# EAGLE schematic rev01 (EAGLE 7.3.0)
CrypTech Novena dev-bridge Revision 01 (c) NORDUnet A/S

## Sheet 1 of 7: CrypTech avalanche noise evaluation board, rev 02
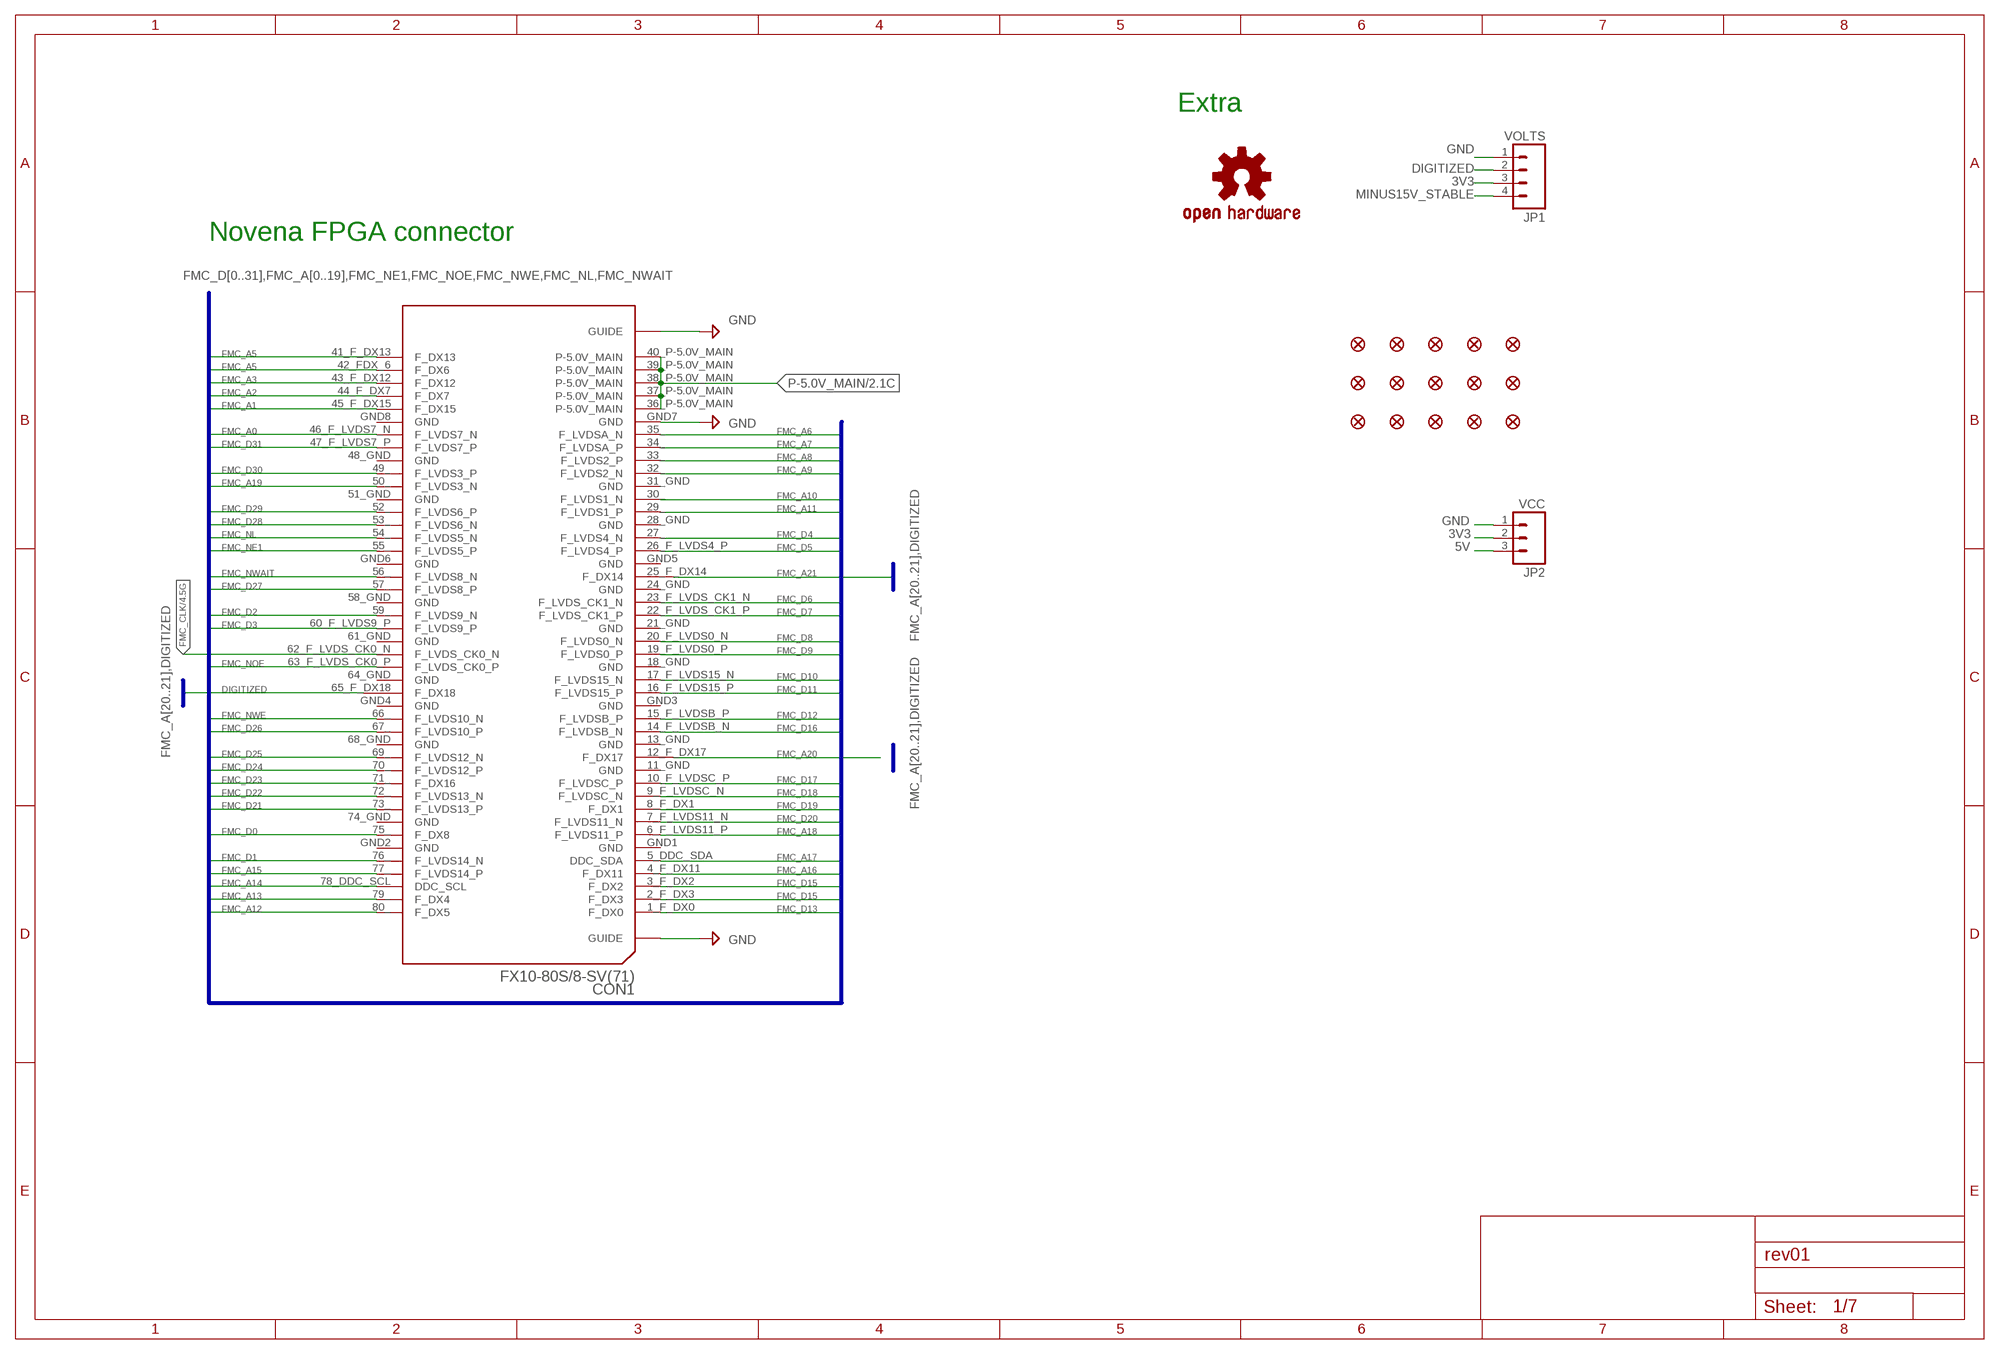
[diagram p0: schematic, sheet 1]

### Parts
CON1  FX10-80S/8-SV(71)  [FX10A-80P/8-SV(71)]
FID1  FIDUCIAL1X2  [FIDUCIAL-1X2]
FID2  FIDUCIAL1X2  [FIDUCIAL-1X2]
FID3  FIDUCIAL1X2  [FIDUCIAL-1X2]
FID4  FIDUCIAL1X2  [FIDUCIAL-1X2]
FID5  FIDUCIAL1X2  [FIDUCIAL-1X2]
FID6  FIDUCIAL1X2  [FIDUCIAL-1X2]
FID7  FIDUCIAL1X2  [FIDUCIAL-1X2]
FID8  FIDUCIAL1X2  [FIDUCIAL-1X2]
FID9  FIDUCIAL1X2  [FIDUCIAL-1X2]
FID10  FIDUCIAL1X2  [FIDUCIAL-1X2]
FID11  FIDUCIAL1X2  [FIDUCIAL-1X2]
FID12  FIDUCIAL1X2  [FIDUCIAL-1X2]
FID13  FIDUCIAL1X2  [FIDUCIAL-1X2]
FID14  FIDUCIAL1X2  [FIDUCIAL-1X2]
FID15  FIDUCIAL1X2  [FIDUCIAL-1X2]
JP1  VOLTS  M04LOCK  [1X04_LOCK]
JP2  VCC  M03LOCK  [1X03_LOCK]
LOGO1  OSHW-LOGOL-COPPER  [OSHW-LOGO-L_COPPER]

### Nets
3V3: JP1.3 JP2.2 ; also sheet 2,3,4,6,7
5V: JP2.3 ; also sheet 2
DIGITIZED: CON1.65_F_DX18(F_DX18) JP1.2 ; also sheet 3
FMC_A0 [FMC ADDR]: CON1.46_F_LVDS7_N(F_LVDS7_N) ; also sheet 4
FMC_A1 [FMC ADDR]: CON1.45_F_DX15(F_DX15) ; also sheet 4
FMC_A2 [FMC ADDR]: CON1.44_F_DX7(F_DX7) ; also sheet 4
FMC_A3 [FMC ADDR]: CON1.43_F_DX12(F_DX12) ; also sheet 4
FMC_A4 [FMC ADDR]: CON1.42_FDX_6(F_DX6) ; also sheet 4
FMC_A5 [FMC ADDR]: CON1.41_F_DX13(F_DX13) ; also sheet 4
FMC_A6 [FMC ADDR]: CON1.35_(F_LVDSA_N) ; also sheet 4
FMC_A7 [FMC ADDR]: CON1.34_(F_LVDSA_P) ; also sheet 4
FMC_A8 [FMC ADDR]: CON1.33_(F_LVDS2_P) ; also sheet 4
FMC_A9 [FMC ADDR]: CON1.32_(F_LVDS2_N) ; also sheet 4
FMC_A10 [FMC ADDR]: CON1.30_(F_LVDS1_N) ; also sheet 4
FMC_A11 [FMC ADDR]: CON1.29_(F_LVDS1_P) ; also sheet 4
FMC_A12 [FMC ADDR]: CON1.80_(F_DX5) ; also sheet 4
FMC_A13 [FMC ADDR]: CON1.79_(F_DX4) ; also sheet 4
FMC_A14 [FMC ADDR]: CON1.78_DDC_SCL(DDC_SCL) ; also sheet 4
FMC_A15 [FMC ADDR]: CON1.77_(F_LVDS14_P) ; also sheet 4
FMC_A16 [FMC ADDR]: CON1.4_F_DX11(F_DX11) ; also sheet 4
FMC_A17 [FMC ADDR]: CON1.5_DDC_SDA(DDC_SDA) ; also sheet 4
FMC_A18 [FMC ADDR]: CON1.6_F_LVDS11_P(F_LVDS11_P) ; also sheet 4
FMC_A19 [FMC ADDR]: CON1.50_(F_LVDS3_N) ; also sheet 4
FMC_A20: CON1.12_F_DX17(F_DX17) ; also sheet 4
FMC_A21: CON1.25_F_DX14(F_DX14) ; also sheet 4
FMC_CLK: CON1.62_F_LVDS_CK0_N(F_LVDS_CK0_N) ; also sheet 4
FMC_D0 [FMC DATA]: CON1.75_(F_DX8) ; also sheet 4
FMC_D1 [FMC DATA]: CON1.76_(F_LVDS14_N) ; also sheet 4
FMC_D2 [FMC DATA]: CON1.59_(F_LVDS9_N) ; also sheet 4
FMC_D3 [FMC DATA]: CON1.60_F_LVDS9_P(F_LVDS9_P) ; also sheet 4
FMC_D4 [FMC DATA]: CON1.27_(F_LVDS4_N) ; also sheet 4
FMC_D5 [FMC DATA]: CON1.26_F_LVDS4_P(F_LVDS4_P) ; also sheet 4
FMC_D6 [FMC DATA]: CON1.23_F_LVDS_CK1_N(F_LVDS_CK1_N) ; also sheet 4
FMC_D7 [FMC DATA]: CON1.22_F_LVDS_CK1_P(F_LVDS_CK1_P) ; also sheet 4
FMC_D8 [FMC DATA]: CON1.20_F_LVDS0_N(F_LVDS0_N) ; also sheet 4
FMC_D9 [FMC DATA]: CON1.19_F_LVDS0_P(F_LVDS0_P) ; also sheet 4
FMC_D10 [FMC DATA]: CON1.17_F_LVDS15_N(F_LVDS15_N) ; also sheet 4
FMC_D11 [FMC DATA]: CON1.16_F_LVDS15_P(F_LVDS15_P) ; also sheet 4
FMC_D12 [FMC DATA]: CON1.15_F_LVDSB_P(F_LVDSB_P) ; also sheet 4
FMC_D13 [FMC DATA]: CON1.1_F_DX0(F_DX0) ; also sheet 4
FMC_D14 [FMC DATA]: CON1.2_F_DX3(F_DX3) ; also sheet 4
FMC_D15 [FMC DATA]: CON1.3_F_DX2(F_DX2) ; also sheet 4
FMC_D16 [FMC DATA]: CON1.14_F_LVDSB_N(F_LVDSB_N) ; also sheet 4
FMC_D17 [FMC DATA]: CON1.10_F_LVDSC_P(F_LVDSC_P) ; also sheet 4
FMC_D18 [FMC DATA]: CON1.9_F_LVDSC_N(F_LVDSC_N) ; also sheet 4
FMC_D19 [FMC DATA]: CON1.8_F_DX1(F_DX1) ; also sheet 4
FMC_D20 [FMC DATA]: CON1.7_F_LVDS11_N(F_LVDS11_N) ; also sheet 4
FMC_D21 [FMC DATA]: CON1.73_(F_LVDS13_P) ; also sheet 4
FMC_D22 [FMC DATA]: CON1.72_(F_LVDS13_N) ; also sheet 4
FMC_D23 [FMC DATA]: CON1.71_(F_DX16) ; also sheet 4
FMC_D24 [FMC DATA]: CON1.70_(F_LVDS12_P) ; also sheet 4
FMC_D25 [FMC DATA]: CON1.69_(F_LVDS12_N) ; also sheet 4
FMC_D26 [FMC DATA]: CON1.67_(F_LVDS10_P) ; also sheet 4
FMC_D27 [FMC DATA]: CON1.57_(F_LVDS8_P) ; also sheet 4
FMC_D28 [FMC DATA]: CON1.53_(F_LVDS6_N) ; also sheet 4
FMC_D29 [FMC DATA]: CON1.52_(F_LVDS6_P) ; also sheet 4
FMC_D30 [FMC DATA]: CON1.49_(F_LVDS3_P) ; also sheet 4
FMC_D31 [FMC DATA]: CON1.47_F_LVDS7_P(F_LVDS7_P) ; also sheet 4
FMC_NE1: CON1.55_(F_LVDS5_P) ; also sheet 4
FMC_NL: CON1.54_(F_LVDS5_N) ; also sheet 4
FMC_NOE: CON1.63_F_LVDS_CK0_P(F_LVDS_CK0_P) ; also sheet 4
FMC_NWAIT: CON1.56_(F_LVDS8_N) ; also sheet 4
FMC_NWE: CON1.66_(F_LVDS10_N) ; also sheet 4
GND [Ground]: CON1.GND7(GND) CON1.GUIDE@L(GUIDE) CON1.GUIDE@R(GUIDE) JP1.1 JP2.1 ; also sheet 2,4,5,6,7
MINUS15V_STABLE: JP1.4 ; also sheet 2,3
P-5.0V_MAIN: CON1.36_P-5.0V_MAIN(P-5.0V_MAIN) CON1.37_P-5.0V_MAIN(P-5.0V_MAIN) CON1.38_P-5.0V_MAIN(P-5.0V_MAIN) CON1.39_P-5.0V_MAIN(P-5.0V_MAIN) CON1.40_P-5.0V_MAIN(P-5.0V_MAIN) ; also sheet 2
Unconnected: CON1.11_GND(GND) CON1.13_GND(GND) CON1.18_GND(GND) CON1.21_GND(GND) CON1.24_GND(GND) CON1.28_GND(GND) CON1.31_GND(GND) CON1.48_GND(GND) CON1.51_GND(GND) CON1.58_GND(GND) CON1.61_GND(GND) CON1.64_GND(GND) CON1.68_GND(GND) CON1.74_GND(GND)

### Buses
FMC_D[0..31],FMC_A[0..19],FMC_NE1,FMC_NOE,FMC_NWE,FMC_NL,FMC_NWAIT
FMC_A[20..21],DIGITIZED

### Notes on the sheet
- Extra
- Novena FPGA connector

## Sheet 2 of 7: Power
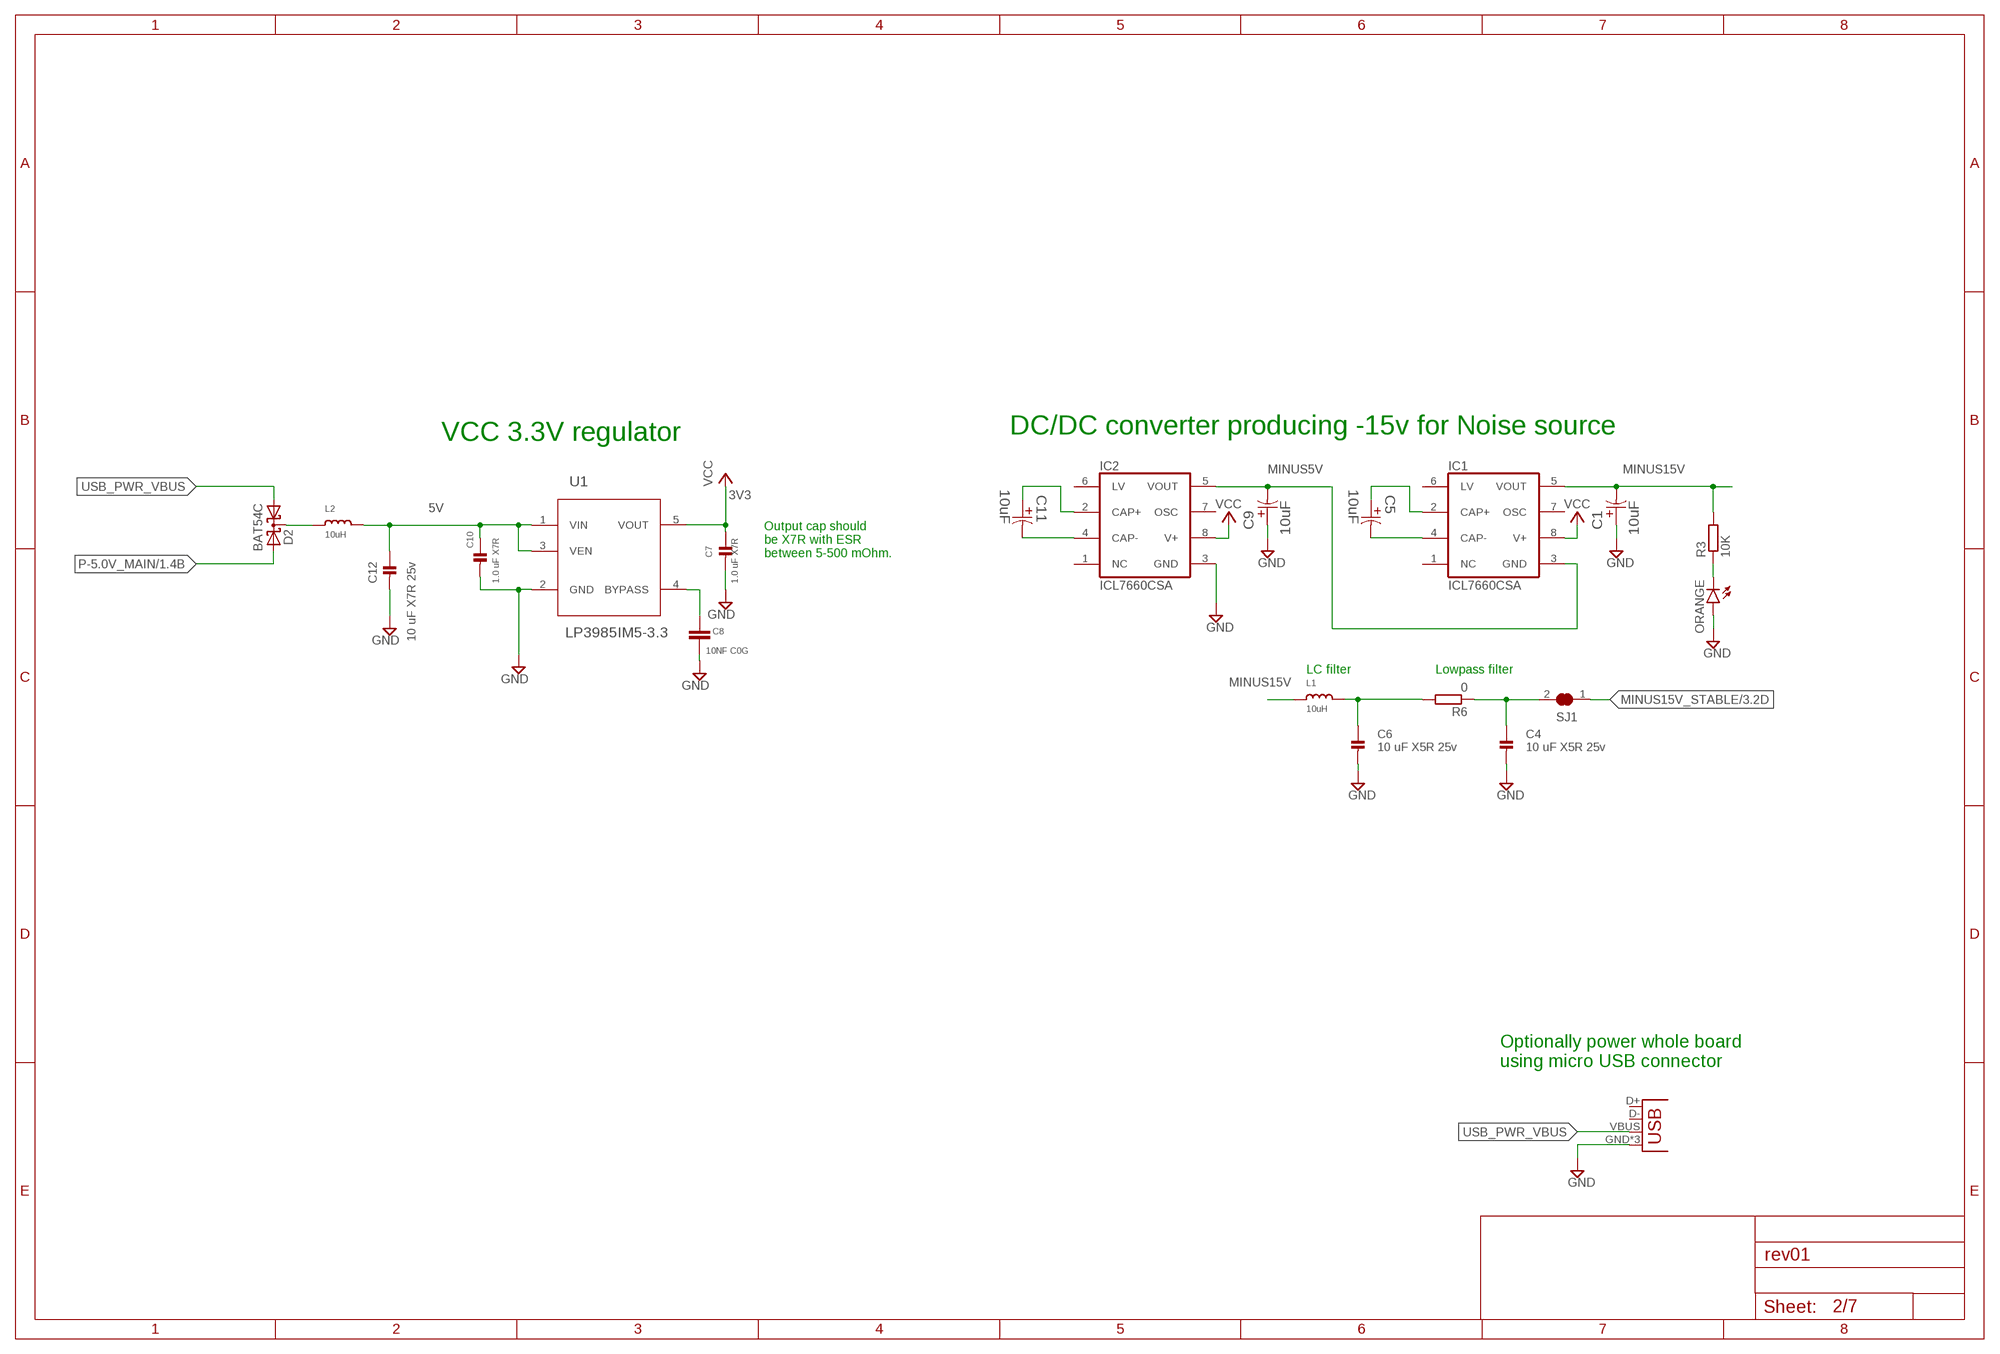
[diagram p1: schematic, sheet 2]

### Parts
C1  10uF  EEE-FK1V100UR  [CAPAE530X610N_BIG_PADS]
C4  10 uF X5R 25v  CAP_CERAMIC_0805  [_0805]
C5  10uF  EEE-FK1V100UR  [CAPAE530X610N_BIG_PADS]
C6  10 uF X5R 25v  CAP_CERAMIC_0805  [_0805]
C7  1.0 uF X7R  CAP_CERAMIC0805  [0805]
C8  10NF C0G  C-EUC0603  [C0603]
C9  10uF  EEE-FK1V100UR  [CAPAE530X610N_BIG_PADS]
C10  1.0 uF X7R  CAP_CERAMIC0805  [0805]
C11  10uF  EEE-FK1V100UR  [CAPAE530X610N_BIG_PADS]
C12  10 uF X7R 25v  CAP_CERAMIC0805  [0805]
D2  BAT54C  [SOT23]
IC1  ICL7660CSA  [SO08]
IC2  ICL7660CSA  [SO08]
L1  10uH  INDUCTOR_0805  [_0805]
L2  10uH  INDUCTOR_0805  [_0805]
ORANGE  LEDAMBER0603  [LED-0603]
R3  10K  R-EU_R0603  [R0603]
R6  0  R-EU_R0603  [R0603]
SJ1  SOLDERJUMPER_CLOSED  [SOLDERJUMPER_CLOSEDWIRE@1]
U1  LP3985IM5-3.3  [SOT95P300X120-5N]
USB_PWR  USB-MICROB  [USB-MICROB]

### Nets
3V3: C7.1 U1.5(VOUT) ; supply symbol labelled VCC ; also sheet 1,3,4,6,7
5V: C10.1 C12.1 IC1.8(V+) IC2.8(V+) L2.2 U1.1(VIN) U1.3(VEN) ; supply symbol labelled VCC ; also sheet 1
GND [Ground]: C1.1 C4.2 C6.2 C7.2 C8.1 C9.1 C10.2 C12.2 IC2.3(GND) ORANGE.A U1.2(GND) USB_PWR.GND USB_PWR.MT1(GND) USB_PWR.MT2(GND) ; also sheet 1,4,5,6,7
MINUS5V: C9.2 IC1.3(GND) IC2.5(VOUT)
MINUS15V: C1.2 IC1.5(VOUT) L1.1 R3.2
MINUS15V_STABLE: SJ1.1 ; also sheet 1,3
N$1: C5.2 IC1.4(CAP-)
N$2: C11.2 IC2.4(CAP-)
N$3: C11.1 IC2.2(CAP+)
N$6: C4.1 R6.1 SJ1.2
N$7: ORANGE.C R3.1
N$8: C8.2 U1.4(BYPASS)
N$9: C5.1 IC1.2(CAP+)
N$11: C6.1 L1.2 R6.2
N$14: D2.3(CC) L2.1
P-5.0V_MAIN: D2.2(A2) ; also sheet 1
USB_PWR_VBUS: D2.1(A1) USB_PWR.VBUS
Unconnected: IC1.1(NC) IC1.6(LV) IC1.7(OSC) IC2.1(NC) IC2.6(LV) IC2.7(OSC) USB_PWR.D+ USB_PWR.D-

### Notes on the sheet
- VCC 3.3V regulator | DC/DC converter producing -15v for Noise source
- Output cap should
  be X7R with ESR
  between 5-500 mOhm.
- LC filter | Lowpass filter
- Optionally power whole board
  using micro USB connector

## Sheet 3 of 7: Noise source
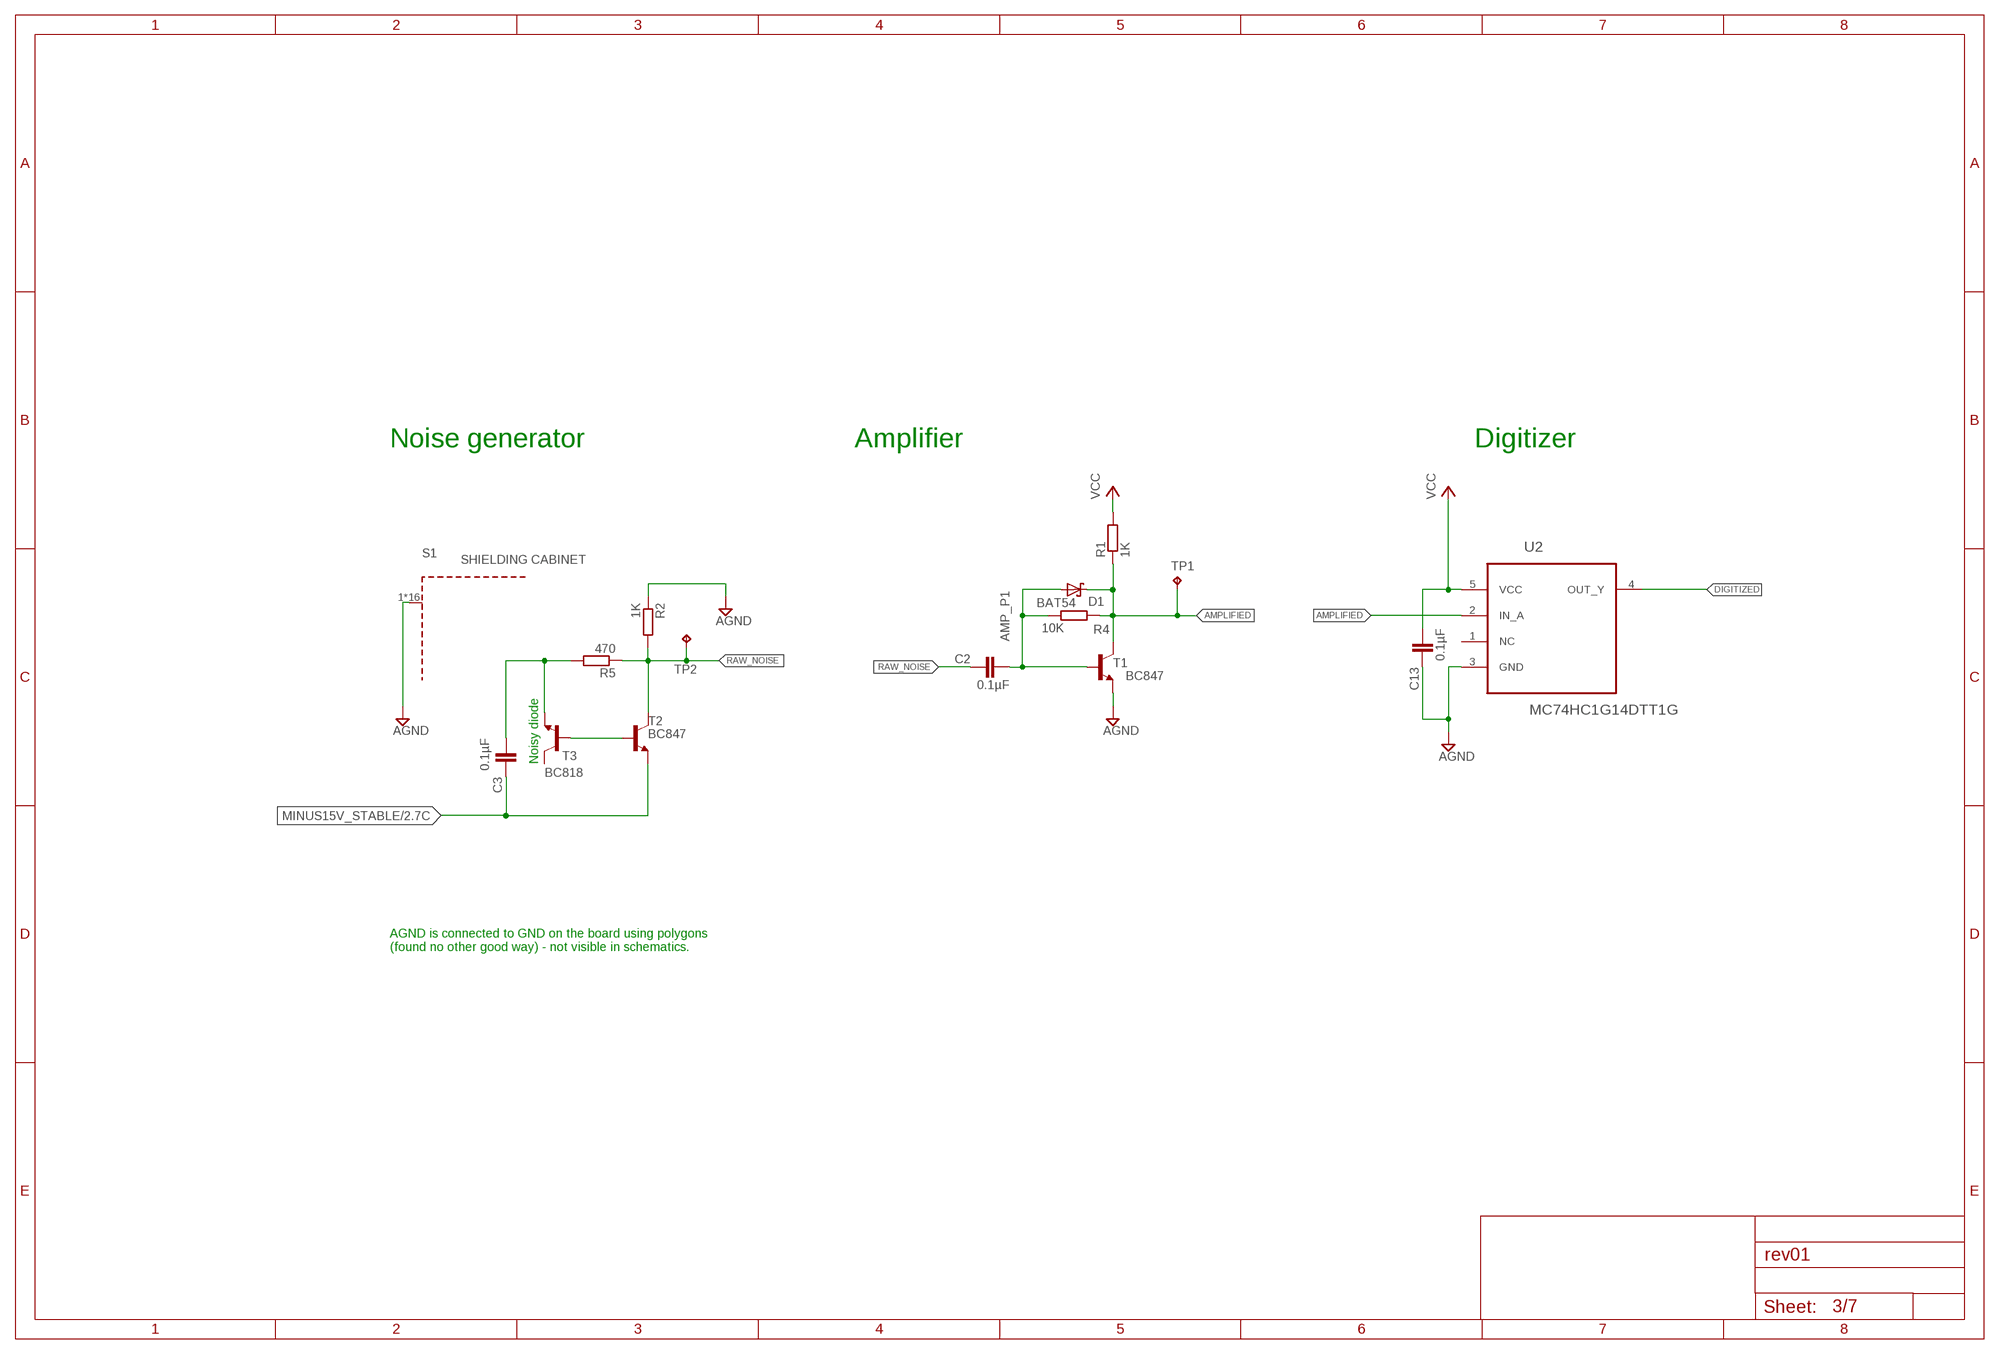
[diagram p2: schematic, sheet 3]

### Parts
C2  0.1µF  C-EUC0603  [C0603]
C3  0.1µF  C-EUC0603  [C0603]
C13  0.1µF  C-EUC0603  [C0603]
D1  BAT54  [SOT23]
R1  1K  R-EU_R0603  [R0603]
R2  1K  R-EU_R0603  [R0603]
R4  10K  R-EU_R0603  [R0603]
R5  470  R-EU_R0603  [R0603]
S1  SHIELDING CABINET  WE-SHC  [WE-SHC_36103205_NO_CREAM]
T1  BC847  [SOT23]
T2  BC847  [SOT23]
T3  BC818  BC818-40SMD  [SOT23-BEC]
TP1  TPB1,27  [B1,27]
TP2  TPB1,27  [B1,27]
U2  MC74HC1G14DTT1G  [SOT95P275X110-5N]

### Nets
3V3: C13.2 R1.2 U2.5(VCC) ; supply symbol labelled VCC ; also sheet 1,2,4,6,7
AGND: C13.1 R2.1 S1.1(GND) S1.2(GND) S1.3(GND) S1.4(GND) S1.5(GND) S1.6(GND) S1.7(GND) S1.8(GND) S1.9(GND) S1.10(GND) S1.11(GND) S1.12(GND) S1.13(GND) S1.14(GND) S1.15(GND) S1.16(GND) T1.2(E) U2.3(GND)
AMP_P1: C2.2 D1.1(A) R4.1 T1.1(B)
AMPLIFIED: D1.3(C) R1.1 R4.2 T1.3(C) TP1.TP U2.2(IN_A)
DIGITIZED: U2.4(OUT_Y) ; also sheet 1
MINUS15V_STABLE: C3.1 T2.2(E) ; also sheet 1,2
NOISE_IN: C3.2 R5.2 T3.E
NOISE_OUT: T2.1(B) T3.B
RAW_NOISE: C2.1 R2.2 R5.1 T2.3(C) TP2.TP
Unconnected: T3.C U2.1(NC)

### Notes on the sheet
- Noise generator | Amplifier | Digitizer
- Noisy diode
- AGND is connected to GND on the board using polygons
  (found no other good way) - not visible in schematics.

## Sheet 4 of 7: ARM Cortex-M4
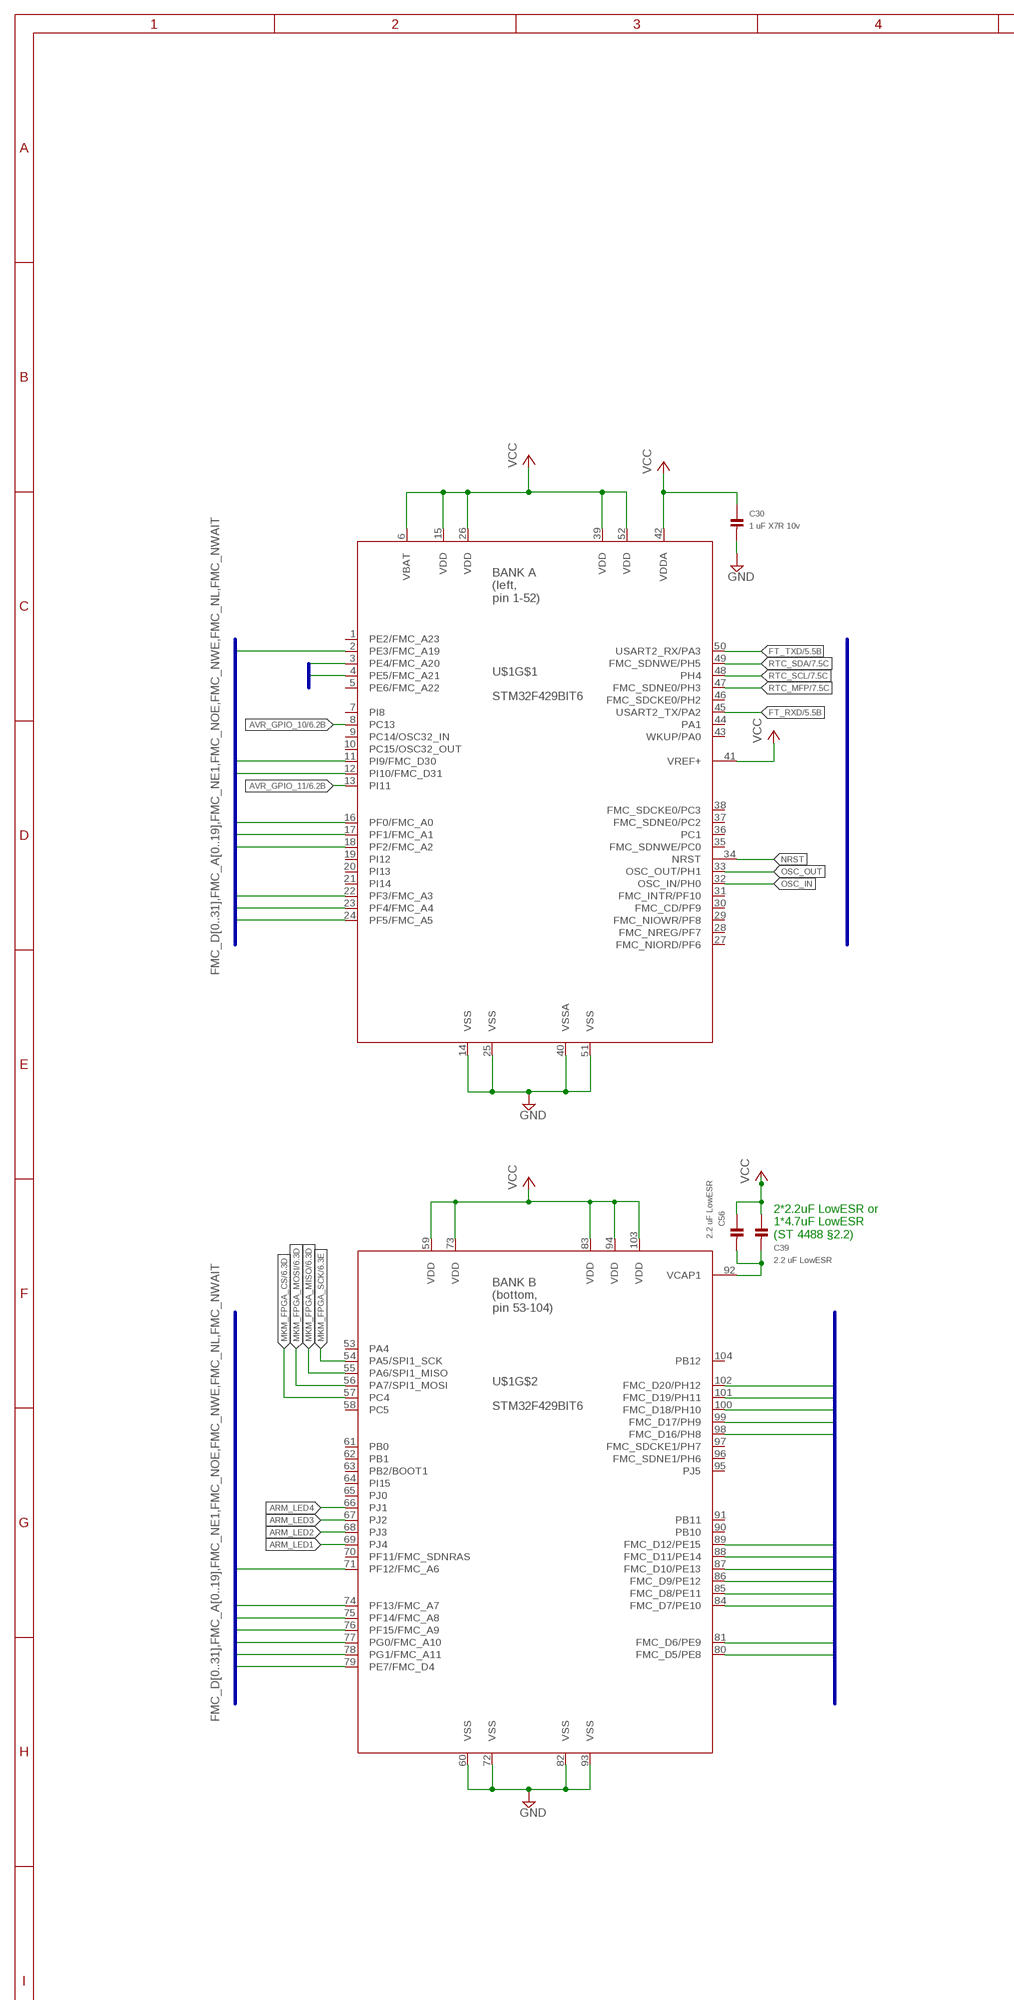
[diagram p3: schematic, sheet 4, part 1 of 2]
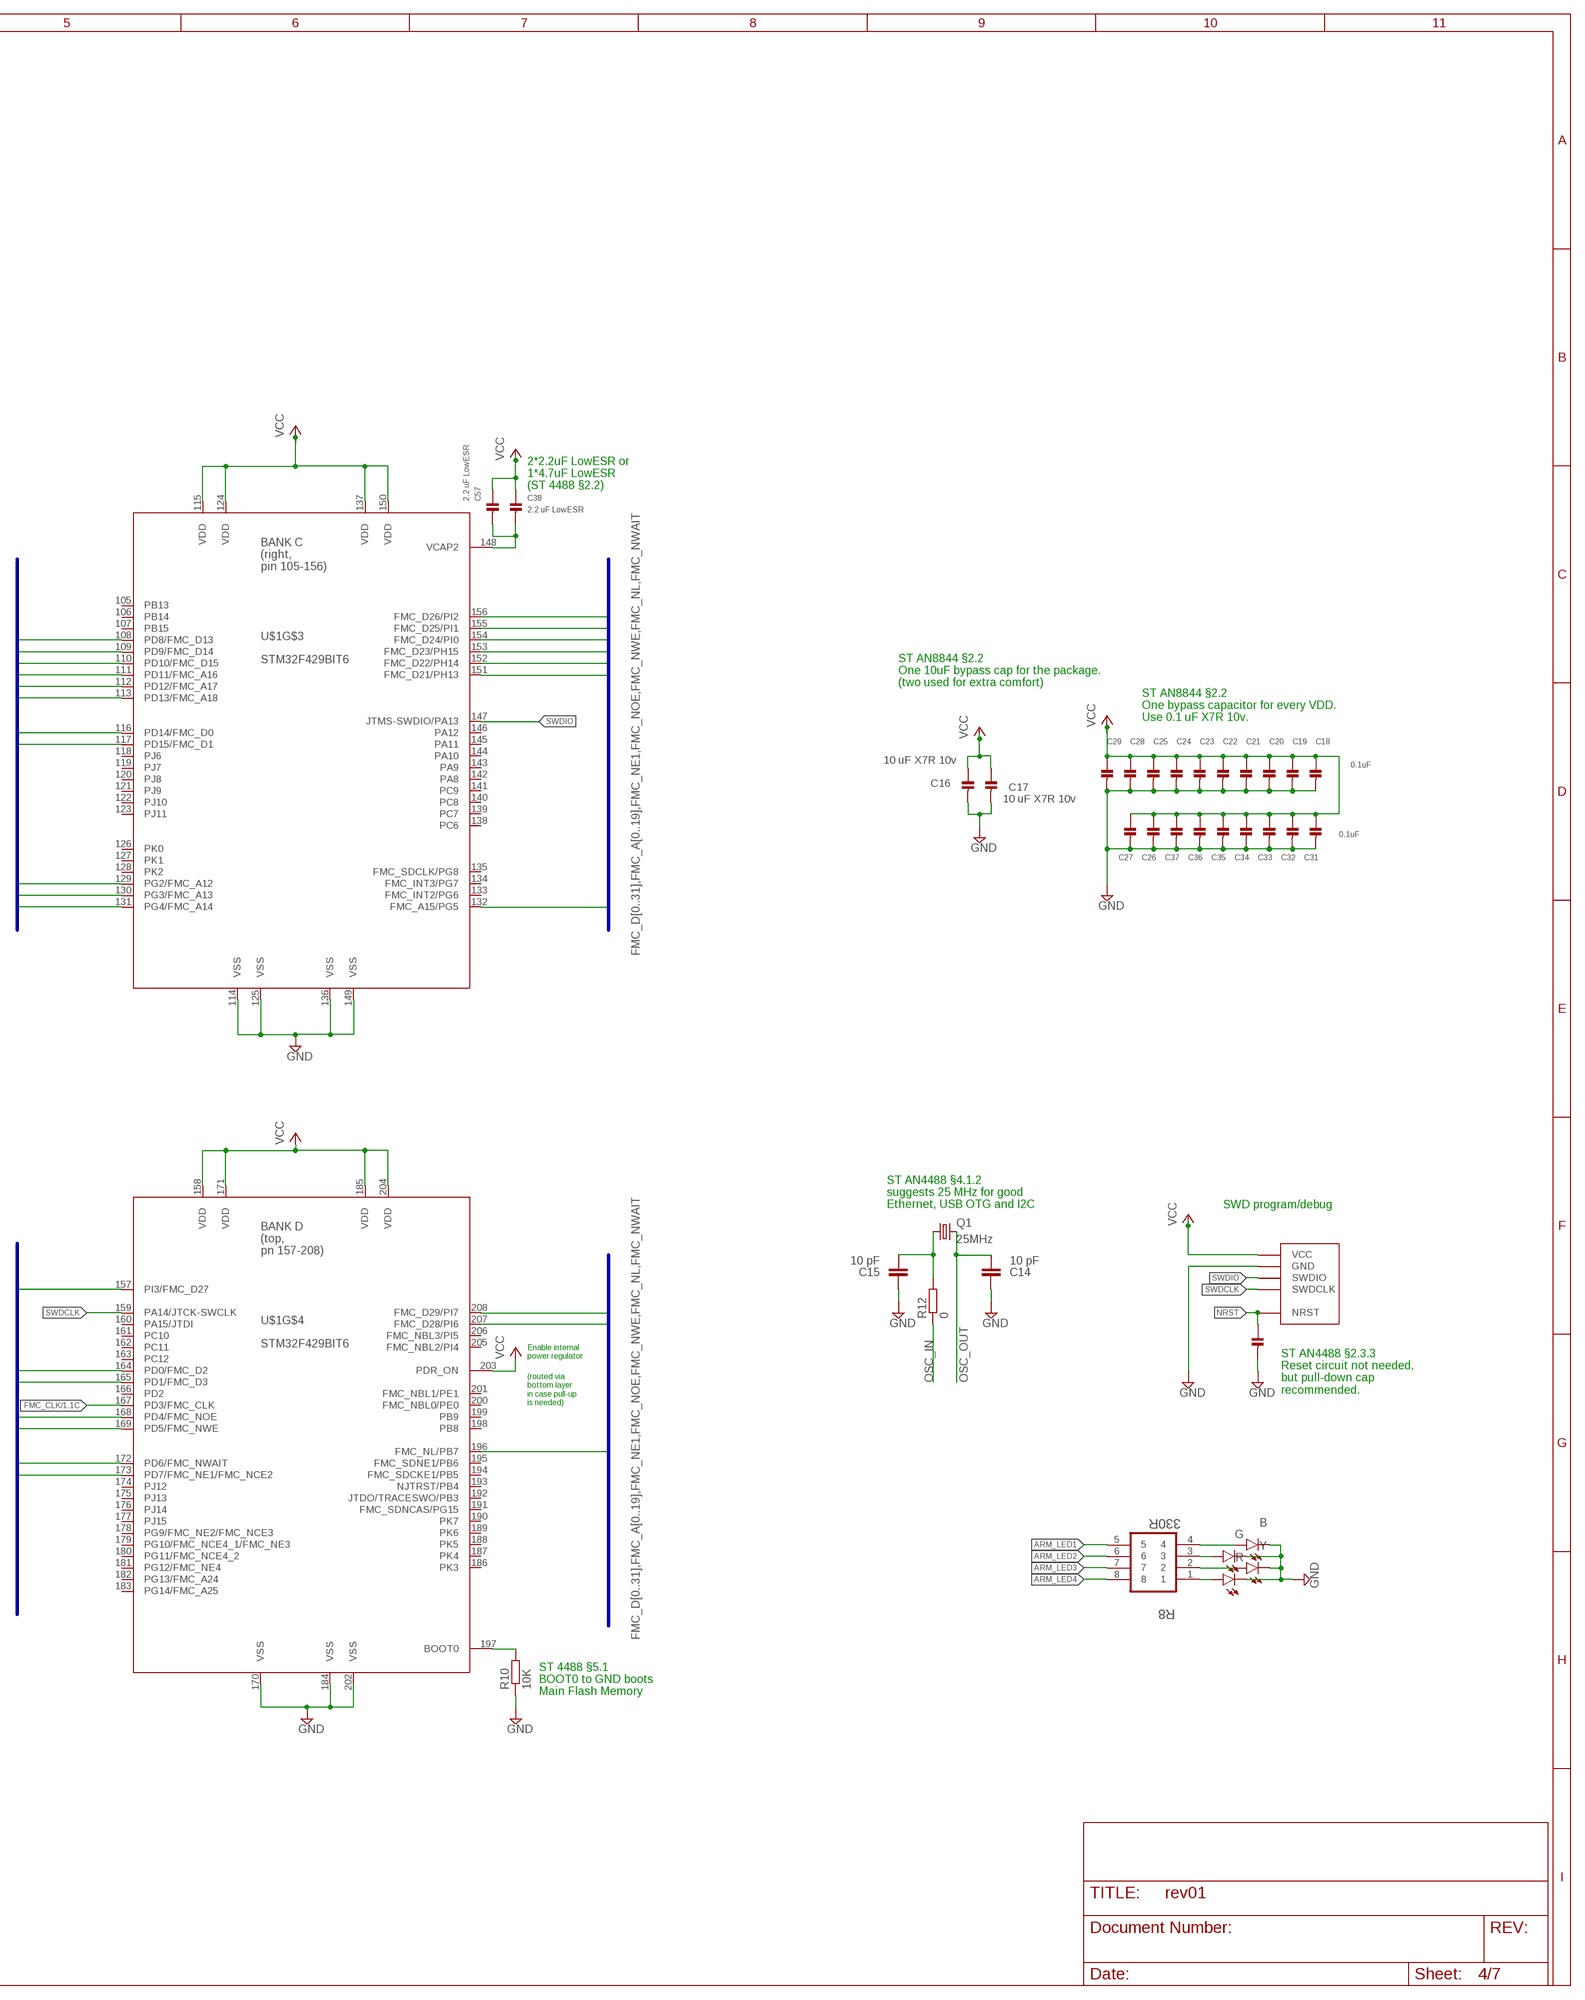
[diagram p4: schematic, sheet 4, part 2 of 2]

### Parts
C14  10 pF  C-EUC0603  [C0603]
C15  10 pF  C-EUC0603  [C0603]
C16  10 uF X7R 10v  CAP_CERAMIC0805  [0805]
C17  10 uF X7R 10v  CAP_CERAMIC0805  [0805]
C18  0.1uF  CAP_CERAMIC0603  [0603]
C19  0.1uF  CAP_CERAMIC0603  [0603]
C20  0.1uF  CAP_CERAMIC0603  [0603]
C21  0.1uF  CAP_CERAMIC0603  [0603]
C22  0.1uF  CAP_CERAMIC0603  [0603]
C23  0.1uF  CAP_CERAMIC0603  [0603]
C24  0.1uF  CAP_CERAMIC0603  [0603]
C25  0.1uF  CAP_CERAMIC0603  [0603]
C26  0.1uF  CAP_CERAMIC0603  [0603]
C27  0.1uF  CAP_CERAMIC0603  [0603]
C28  0.1uF  CAP_CERAMIC0603  [0603]
C29  0.1uF  CAP_CERAMIC0603  [0603]
C30  1 uF X7R 10v  CAP_CERAMIC0603  [0603]
C31  0.1uF  CAP_CERAMIC0603  [0603]
C32  0.1uF  CAP_CERAMIC0603  [0603]
C33  0.1uF  CAP_CERAMIC0603  [0603]
C34  0.1uF  CAP_CERAMIC0603  [0603]
C35  0.1uF  CAP_CERAMIC0603  [0603]
C36  0.1uF  CAP_CERAMIC0603  [0603]
C37  0.1uF  CAP_CERAMIC0603  [0603]
C38  2.2 uF LowESR  CAP_CERAMIC0603  [0603]
C39  2.2 uF LowESR  CAP_CERAMIC0603  [0603]
C40  0.1uF  CAP_CERAMIC0603  [0603]
C56  2.2 uF LowESR  CAP_CERAMIC0603  [0603]
C57  2.2 uF LowESR  CAP_CERAMIC0603  [0603]
LED5  B  LED0603  [LED-0603]
LED6  G  LED0603  [LED-0603]
LED7  Y  LED0603  [LED-0603]
LED8  R  LED0603  [LED-0603]
Q1  25MHz  CRYSTALCTS406  [CTS406]
R8  330R  EXB38V331JV  [RESCAXE80P320X160X60-8N]
R10  10K  R-EU_R0603  [R0603]
R12  0  R-EU_R0603  [R0603]
U$1  STM32F429BIT6  [LQFP-208]
U$2  STM32-SWD  [100MIL_THT]

### Nets
3V3: C16.1 C17.1 C18.1 C19.1 C20.1 C21.1 C22.1 C23.1 C24.1 C25.1 C26.1 C27.1 C28.1 C29.1 C30.1 C31.1 C32.1 C33.1 C34.1 C35.1 C36.1 C37.1 C38.1 C39.1 C56.1 C57.1 U$1.6(VBAT) U$1.15(VDD) U$1.26(VDD) U$1.39(VDD) U$1.41(VREF+) U$1.42(VDDA) U$1.52(VDD) U$1.59(VDD) U$1.73(VDD) U$1.83(VDD) U$1.94(VDD) U$1.103(VDD) U$1.115(VDD) U$1.124(VDD) U$1.137(VDD) U$1.150(VDD) U$1.158(VDD) U$1.171(VDD) U$1.185(VDD) U$1.203(PDR_ON) U$1.204(VDD) U$2.P$VCC(VCC) ; supply symbol labelled VCC ; also sheet 1,2,3,6,7
ARM_LED1: R8.5 U$1.69(PJ4)
ARM_LED2: R8.6 U$1.68(PJ3)
ARM_LED3: R8.7 U$1.67(PJ2)
ARM_LED4: R8.8 U$1.66(PJ1)
AVR_GPIO_10: U$1.8(PC13) ; also sheet 6
AVR_GPIO_11: U$1.13(PI11) ; also sheet 6
BOOT0 [Ground]: R10.2 U$1.197(BOOT0)
FMC_A0 [FMC ADDR]: U$1.16(PF0/FMC_A0) ; also sheet 1
FMC_A1 [FMC ADDR]: U$1.17(PF1/FMC_A1) ; also sheet 1
FMC_A2 [FMC ADDR]: U$1.18(PF2/FMC_A2) ; also sheet 1
FMC_A3 [FMC ADDR]: U$1.22(PF3/FMC_A3) ; also sheet 1
FMC_A4 [FMC ADDR]: U$1.23(PF4/FMC_A4) ; also sheet 1
FMC_A5 [FMC ADDR]: U$1.24(PF5/FMC_A5) ; also sheet 1
FMC_A6 [FMC ADDR]: U$1.71(PF12/FMC_A6) ; also sheet 1
FMC_A7 [FMC ADDR]: U$1.74(PF13/FMC_A7) ; also sheet 1
FMC_A8 [FMC ADDR]: U$1.75(PF14/FMC_A8) ; also sheet 1
FMC_A9 [FMC ADDR]: U$1.76(PF15/FMC_A9) ; also sheet 1
FMC_A10 [FMC ADDR]: U$1.77(PG0/FMC_A10) ; also sheet 1
FMC_A11 [FMC ADDR]: U$1.78(PG1/FMC_A11) ; also sheet 1
FMC_A12 [FMC ADDR]: U$1.129(PG2/FMC_A12) ; also sheet 1
FMC_A13 [FMC ADDR]: U$1.130(PG3/FMC_A13) ; also sheet 1
FMC_A14 [FMC ADDR]: U$1.131(PG4/FMC_A14) ; also sheet 1
FMC_A15 [FMC ADDR]: U$1.132(FMC_A15/PG5) ; also sheet 1
FMC_A16 [FMC ADDR]: U$1.111(PD11/FMC_A16) ; also sheet 1
FMC_A17 [FMC ADDR]: U$1.112(PD12/FMC_A17) ; also sheet 1
FMC_A18 [FMC ADDR]: U$1.113(PD13/FMC_A18) ; also sheet 1
FMC_A19 [FMC ADDR]: U$1.2(PE3/FMC_A19) ; also sheet 1
FMC_A20: U$1.3(PE4/FMC_A20) ; also sheet 1
FMC_A21: U$1.4(PE5/FMC_A21) ; also sheet 1
FMC_CLK: U$1.167(PD3/FMC_CLK) ; also sheet 1
FMC_D0 [FMC DATA]: U$1.116(PD14/FMC_D0) ; also sheet 1
FMC_D1 [FMC DATA]: U$1.117(PD15/FMC_D1) ; also sheet 1
FMC_D2 [FMC DATA]: U$1.164(PD0/FMC_D2) ; also sheet 1
FMC_D3 [FMC DATA]: U$1.165(PD1/FMC_D3) ; also sheet 1
FMC_D4 [FMC DATA]: U$1.79(PE7/FMC_D4) ; also sheet 1
FMC_D5 [FMC DATA]: U$1.80(FMC_D5/PE8) ; also sheet 1
FMC_D6 [FMC DATA]: U$1.81(FMC_D6/PE9) ; also sheet 1
FMC_D7 [FMC DATA]: U$1.84(FMC_D7/PE10) ; also sheet 1
FMC_D8 [FMC DATA]: U$1.85(FMC_D8/PE11) ; also sheet 1
FMC_D9 [FMC DATA]: U$1.86(FMC_D9/PE12) ; also sheet 1
FMC_D10 [FMC DATA]: U$1.87(FMC_D10/PE13) ; also sheet 1
FMC_D11 [FMC DATA]: U$1.88(FMC_D11/PE14) ; also sheet 1
FMC_D12 [FMC DATA]: U$1.89(FMC_D12/PE15) ; also sheet 1
FMC_D13 [FMC DATA]: U$1.108(PD8/FMC_D13) ; also sheet 1
FMC_D14 [FMC DATA]: U$1.109(PD9/FMC_D14) ; also sheet 1
FMC_D15 [FMC DATA]: U$1.110(PD10/FMC_D15) ; also sheet 1
FMC_D16 [FMC DATA]: U$1.98(FMC_D16/PH8) ; also sheet 1
FMC_D17 [FMC DATA]: U$1.99(FMC_D17/PH9) ; also sheet 1
FMC_D18 [FMC DATA]: U$1.100(FMC_D18/PH10) ; also sheet 1
FMC_D19 [FMC DATA]: U$1.101(FMC_D19/PH11) ; also sheet 1
FMC_D20 [FMC DATA]: U$1.102(FMC_D20/PH12) ; also sheet 1
FMC_D21 [FMC DATA]: U$1.151(FMC_D21/PH13) ; also sheet 1
FMC_D22 [FMC DATA]: U$1.152(FMC_D22/PH14) ; also sheet 1
FMC_D23 [FMC DATA]: U$1.153(FMC_D23/PH15) ; also sheet 1
FMC_D24 [FMC DATA]: U$1.154(FMC_D24/PI0) ; also sheet 1
FMC_D25 [FMC DATA]: U$1.155(FMC_D25/PI1) ; also sheet 1
FMC_D26 [FMC DATA]: U$1.156(FMC_D26/PI2) ; also sheet 1
FMC_D27 [FMC DATA]: U$1.157(PI3/FMC_D27) ; also sheet 1
FMC_D28 [FMC DATA]: U$1.207(FMC_D28/PI6) ; also sheet 1
FMC_D29 [FMC DATA]: U$1.208(FMC_D29/PI7) ; also sheet 1
FMC_D30 [FMC DATA]: U$1.11(PI9/FMC_D30) ; also sheet 1
FMC_D31 [FMC DATA]: U$1.12(PI10/FMC_D31) ; also sheet 1
FMC_NE1: U$1.173(PD7/FMC_NE1/FMC_NCE2) ; also sheet 1
FMC_NL: U$1.196(FMC_NL/PB7) ; also sheet 1
FMC_NOE: U$1.168(PD4/FMC_NOE) ; also sheet 1
FMC_NWAIT: U$1.172(PD6/FMC_NWAIT) ; also sheet 1
FMC_NWE: U$1.169(PD5/FMC_NWE) ; also sheet 1
FT_RXD: U$1.45(USART2_TX/PA2) ; also sheet 5
FT_TXD: U$1.50(USART2_RX/PA3) ; also sheet 5
GND [Ground]: C14.1 C15.1 C16.2 C17.2 C18.2 C19.2 C20.2 C21.2 C22.2 C23.2 C24.2 C25.2 C26.2 C27.2 C28.2 C29.2 C30.2 C31.2 C32.2 C33.2 C34.2 C35.2 C36.2 C37.2 C40.2 LED5.C LED6.C LED7.C LED8.C R10.1 U$1.14(VSS) U$1.25(VSS) U$1.40(VSSA) U$1.51(VSS) U$1.60(VSS) U$1.72(VSS) U$1.82(VSS) U$1.93(VSS) U$1.114(VSS) U$1.125(VSS) U$1.136(VSS) U$1.149(VSS) U$1.170(VSS) U$1.184(VSS) U$1.202(VSS) U$2.P$GND(GND) ; also sheet 1,2,5,6,7
MKM_FPGA_CS: U$1.57(PC4) ; also sheet 6
MKM_FPGA_MISO: U$1.55(PA6/SPI1_MISO) ; also sheet 6
MKM_FPGA_MOSI: U$1.56(PA7/SPI1_MOSI) ; also sheet 6
MKM_FPGA_SCK: U$1.54(PA5/SPI1_SCK) ; also sheet 6
N$17: LED5.A R8.4
N$18: LED6.A R8.3
N$19: LED7.A R8.2
N$20: LED8.A R8.1
N$21: C15.2 Q1.1 R12.2
NRST: C40.1 U$1.34(NRST) U$2.P$NRST(NRST)
OSC_IN: R12.1 U$1.32(OSC_IN/PH0)
OSC_OUT: C14.2 Q1.3 U$1.33(OSC_OUT/PH1)
RTC_MFP: U$1.47(FMC_SDNE0/PH3) ; also sheet 7
RTC_SCL: U$1.48(PH4) ; also sheet 7
RTC_SDA: U$1.49(FMC_SDNWE/PH5) ; also sheet 7
SWDCLK: U$1.159(PA14/JTCK-SWCLK) U$2.P$SWDCLK(SWDCLK)
SWDIO: U$1.147(JTMS-SWDIO/PA13) U$2.P$SWDIO(SWDIO)
VCAP1: C39.2 C56.2 U$1.92(VCAP1)
VCAP2: C38.2 C57.2 U$1.148(VCAP2)
Unconnected: U$1.1(PE2/FMC_A23) U$1.5(PE6/FMC_A22) U$1.7(PI8) U$1.9(PC14/OSC32_IN) U$1.10(PC15/OSC32_OUT) U$1.19(PI12) U$1.20(PI13) U$1.21(PI14) U$1.27(FMC_NIORD/PF6) U$1.28(FMC_NREG/PF7) U$1.29(FMC_NIOWR/PF8) U$1.30(FMC_CD/PF9) U$1.31(FMC_INTR/PF10) U$1.35(FMC_SDNWE/PC0) U$1.36(PC1) U$1.37(FMC_SDNE0/PC2) U$1.38(FMC_SDCKE0/PC3) U$1.43(WKUP/PA0) U$1.44(PA1) U$1.46(FMC_SDCKE0/PH2) U$1.53(PA4) U$1.58(PC5) U$1.61(PB0) U$1.62(PB1) U$1.63(PB2/BOOT1) U$1.64(PI15) U$1.65(PJ0) U$1.70(PF11/FMC_SDNRAS) U$1.90(PB10) U$1.91(PB11) U$1.95(PJ5) U$1.96(FMC_SDNE1/PH6) U$1.97(FMC_SDCKE1/PH7) U$1.104(PB12) U$1.105(PB13) U$1.106(PB14) U$1.107(PB15) U$1.118(PJ6) U$1.119(PJ7) U$1.120(PJ8) U$1.121(PJ9) U$1.122(PJ10) U$1.123(PJ11) U$1.126(PK0) U$1.127(PK1) U$1.128(PK2) U$1.133(FMC_INT2/PG6) U$1.134(FMC_INT3/PG7) U$1.135(FMC_SDCLK/PG8) U$1.138(PC6) U$1.139(PC7) U$1.140(PC8) U$1.141(PC9) U$1.142(PA8) U$1.143(PA9) U$1.144(PA10) U$1.145(PA11) U$1.146(PA12) U$1.160(PA15/JTDI) U$1.161(PC10) U$1.162(PC11) U$1.163(PC12) U$1.166(PD2) U$1.174(PJ12) U$1.175(PJ13) U$1.176(PJ14) U$1.177(PJ15) U$1.178(PG9/FMC_NE2/FMC_NCE3) U$1.179(PG10/FMC_NCE4_1/FMC_NE3) U$1.180(PG11/FMC_NCE4_2) U$1.181(PG12/FMC_NE4) U$1.182(PG13/FMC_A24) U$1.183(PG14/FMC_A25) U$1.186(PK3) U$1.187(PK4) U$1.188(PK5) U$1.189(PK6) U$1.190(PK7) U$1.191(FMC_SDNCAS/PG15) U$1.192(JTDO/TRACESWO/PB3) U$1.193(NJTRST/PB4) U$1.194(FMC_SDCKE1/PB5) U$1.195(FMC_SDNE1/PB6) U$1.198(PB8) U$1.199(PB9) U$1.200(FMC_NBL0/PE0) U$1.201(FMC_NBL1/PE1) U$1.205(FMC_NBL2/PI4) U$1.206(FMC_NBL3/PI5)

### Buses
FMC_D[0..31],FMC_A[0..19],FMC_NE1,FMC_NOE,FMC_NWE,FMC_NL,FMC_NWAIT
FMC_A[20..21],DIGITIZED

### Notes on the sheet
- 2*2.2uF LowESR or
  1*4.7uF LowESR
  (ST 4488 §2.2)
- ST AN8844 §2.2
  One 10uF bypass cap for the package.
  (two used for extra comfort)
- ST AN8844 §2.2
  One bypass capacitor for every VDD.
  Use 0.1 uF X7R 10v.
- 2*2.2uF LowESR or
  1*4.7uF LowESR
  (ST 4488 §2.2)
- ST AN4488 §4.1.2
  suggests 25 MHz for good
  Ethernet, USB OTG and I2C
- SWD program/debug
- Enable internal
  power regulator
- ST AN4488 §2.3.3
  Reset circuit not needed,
  but pull-down cap
  recommended.
- (routed via
  bottom layer
  in case pull-up
  is needed)
- ST 4488 §5.1
  BOOT0 to GND boots
  Main Flash Memory

## Sheet 5 of 7: USB-UART interface
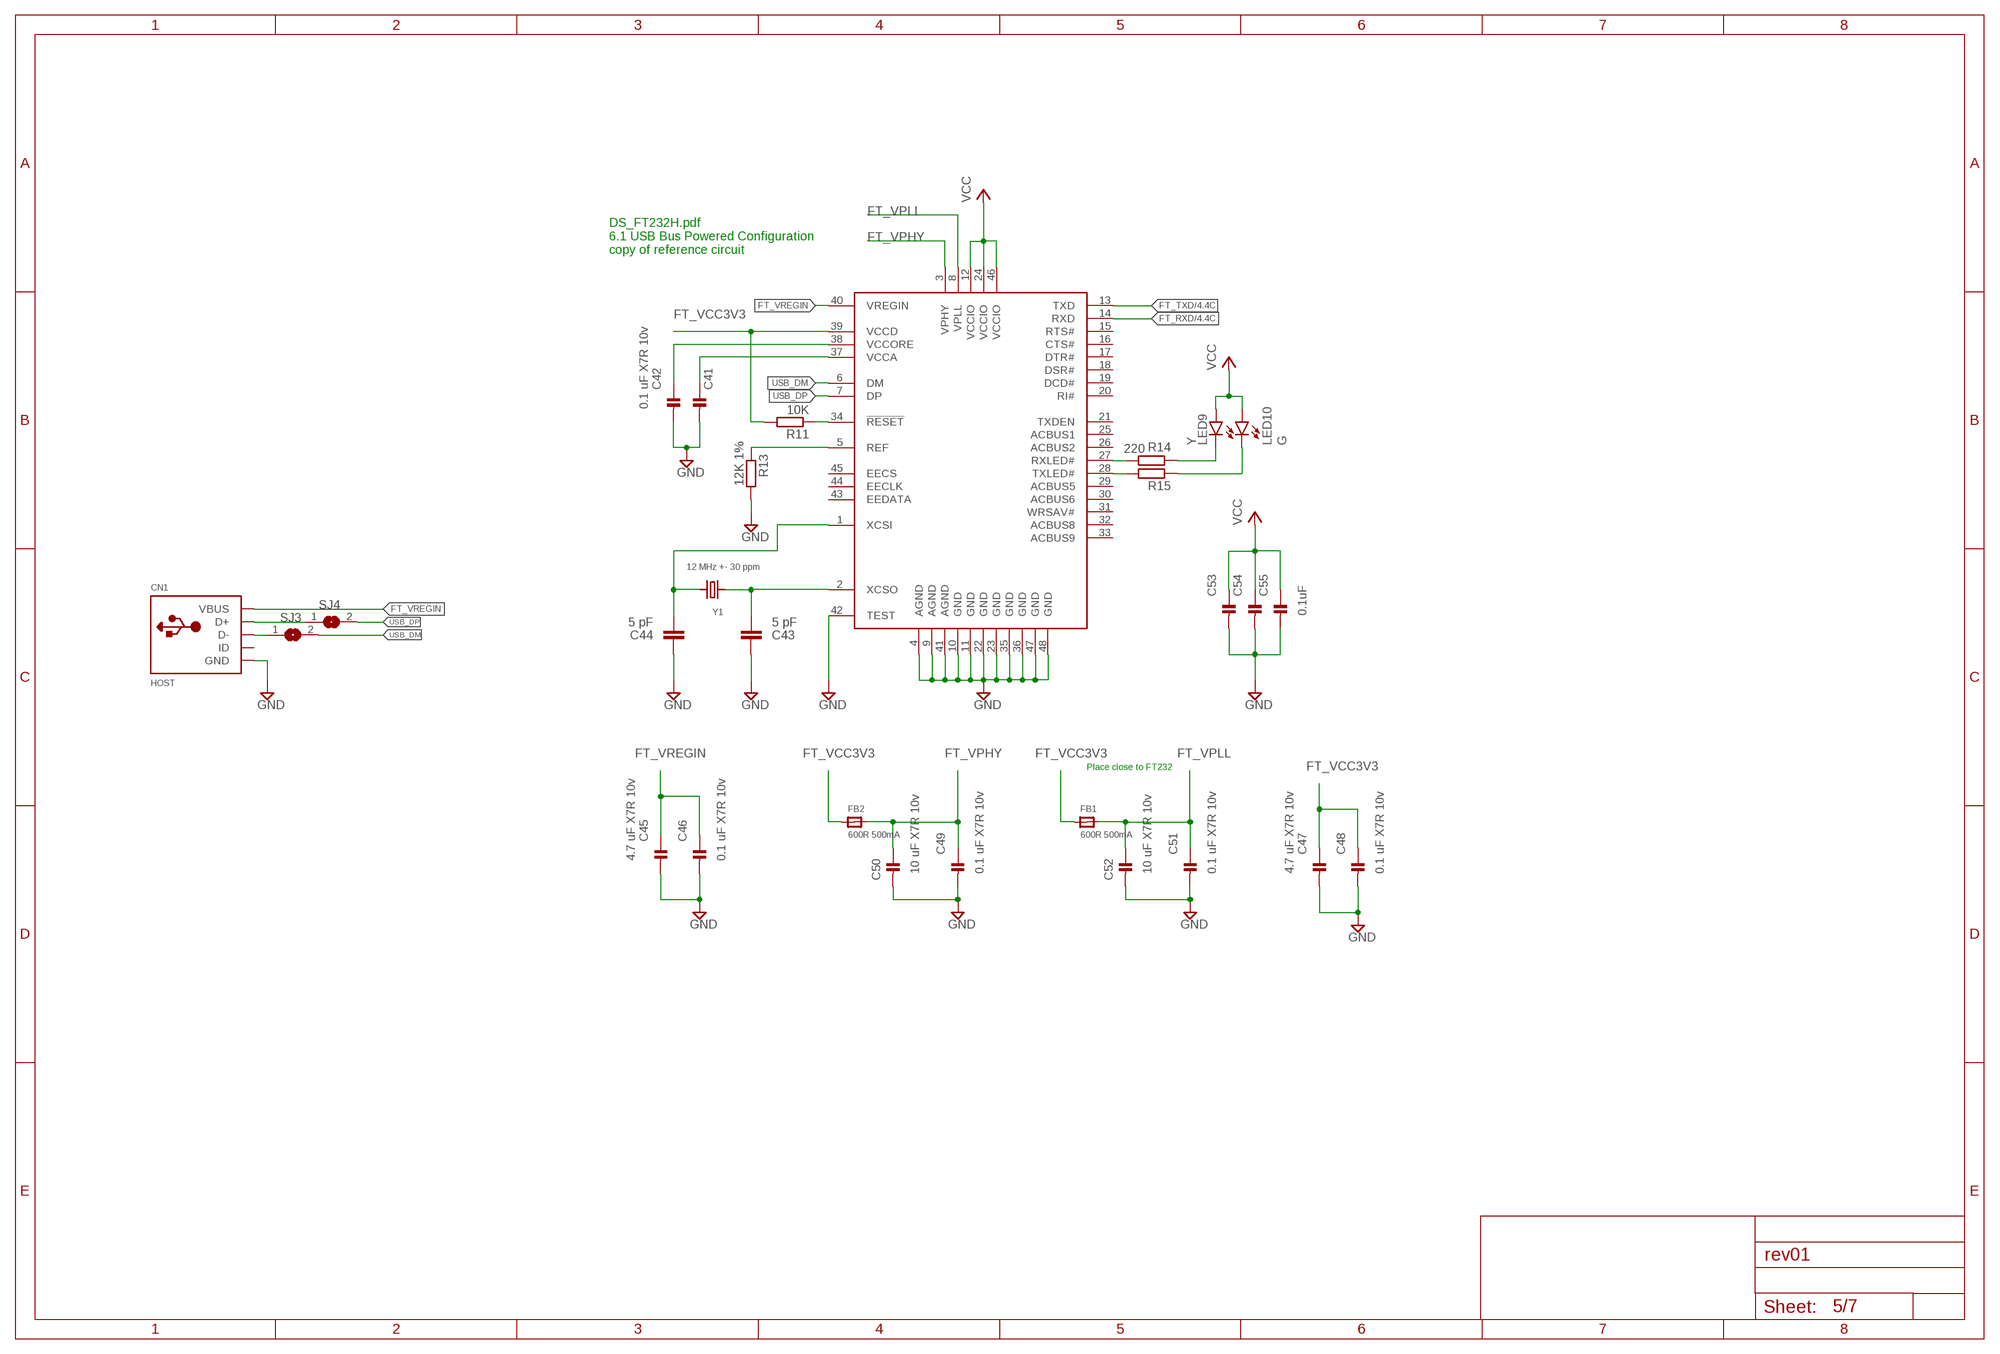
[diagram p5: schematic, sheet 5]

### Parts
C41  0.1 uF X7R 10v  CAP_CERAMIC0603  [0603]
C42  0.1 uF X7R 10v  CAP_CERAMIC0603  [0603]
C43  5 pF  C-EUC0603  [C0603]
C44  5 pF  C-EUC0603  [C0603]
C45  4.7 uF X7R 10v  CAP_CERAMIC0603  [0603]
C46  0.1 uF X7R 10v  CAP_CERAMIC0603  [0603]
C47  4.7 uF X7R 10v  CAP_CERAMIC0603  [0603]
C48  0.1 uF X7R 10v  CAP_CERAMIC0603  [0603]
C49  0.1 uF X7R 10v  CAP_CERAMIC0603  [0603]
C50  10 uF X7R 10v  CAP_CERAMIC_0805  [_0805]
C51  0.1 uF X7R 10v  CAP_CERAMIC0603  [0603]
C52  10 uF X7R 10v  CAP_CERAMIC_0805  [_0805]
C53  0.1uF  CAP_CERAMIC0603  [0603]
C54  0.1uF  CAP_CERAMIC0603  [0603]
C55  0.1uF  CAP_CERAMIC0603  [0603]
CN1  HOST  USBMINIB  [USB-MINIB]
FB1  600R 500mA  FERRITE_0603MP  [_0603MP]
FB2  600R 500mA  FERRITE_0603MP  [_0603MP]
LED9  Y  LED0603  [LED-0603]
LED10  G  LED0603  [LED-0603]
R11  10K  R-EU_R0603  [R0603]
R13  12K 1%  R-EU_R0603  [R0603]
R14  220  R-EU_R0603  [R0603]
R15  220  R-EU_R0603  [R0603]
SJ3  SOLDERJUMPERCLOSED  [SOLDERJUMPER_CLOSEDWIRE]
SJ4  SOLDERJUMPERCLOSED  [SOLDERJUMPER_CLOSEDWIRE]
U$3  FT232H_SERIAL  [FT2323HL_LQFP48]
Y1  12 MHz +- 30 ppm  CRYSTALTHIN  [CRYSTAL_3.2X2.5]

### Nets
FT_REF: R13.1 U$3.5(REF)
FT_RESET: R11.1 U$3.34(!RESET)
FT_RXD: U$3.14(RXD) ; also sheet 4
FT_RXLED: R14.2 U$3.27(RXLED#)
FT_TXD: U$3.13(TXD) ; also sheet 4
FT_TXLED: R15.2 U$3.28(TXLED#)
FT_VCC3V3: C47.1 C48.1 C53.1 C54.1 C55.1 FB1.1 FB2.1 LED9.A LED10.A R11.2 U$3.12(VCCIO) U$3.24(VCCIO) U$3.39(VCCD) U$3.46(VCCIO) ; supply symbol labelled VCC
FT_VCCA: C41.1 U$3.37(VCCA)
FT_VCCORE: C42.1 U$3.38(VCCORE)
FT_VPHY: C49.1 C50.1 FB2.2 U$3.3(VPHY)
FT_VPLL: C51.1 C52.1 FB1.2 U$3.8(VPLL)
FT_VREGIN: C45.1 C46.1 CN1.VBUS U$3.40(VREGIN)
GND [Ground]: C41.2 C42.2 C43.1 C44.1 C45.2 C46.2 C47.2 C48.2 C49.2 C50.2 C51.2 C52.2 C53.2 C54.2 C55.2 CN1.GND R13.2 U$3.4(AGND) U$3.9(AGND) U$3.10(GND) U$3.11(GND) U$3.22(GND) U$3.23(GND) U$3.35(GND) U$3.36(GND) U$3.41(AGND) U$3.42(TEST) U$3.47(GND) U$3.48(GND) ; also sheet 1,2,4,6,7
N$13: C44.2 U$3.1(XCSI) Y1.1
N$22: C43.2 U$3.2(XCSO) Y1.2
N$24: LED9.C R14.1
N$26: LED10.C R15.1
USB_DM: SJ3.2 U$3.6(DM)
USB_DP: SJ4.2 U$3.7(DP)
USBDM: CN1.D- SJ3.1
USBDP: CN1.D+ SJ4.1
Unconnected: CN1.ID U$3.15(RTS#) U$3.16(CTS#) U$3.17(DTR#) U$3.18(DSR#) U$3.19(DCD#) U$3.20(RI#) U$3.21(TXDEN) U$3.25(ACBUS1) U$3.26(ACBUS2) U$3.29(ACBUS5) U$3.30(ACBUS6) U$3.31(WRSAV#) U$3.32(ACBUS8) U$3.33(ACBUS9) U$3.43(EEDATA) U$3.44(EECLK) U$3.45(EECS)

### Notes on the sheet
- DS_FT232H.pdf
  6.1 USB Bus Powered Configuration
  copy of reference circuit
- Place close to FT232

## Sheet 6 of 7: Tamper circuit Master Key Memory
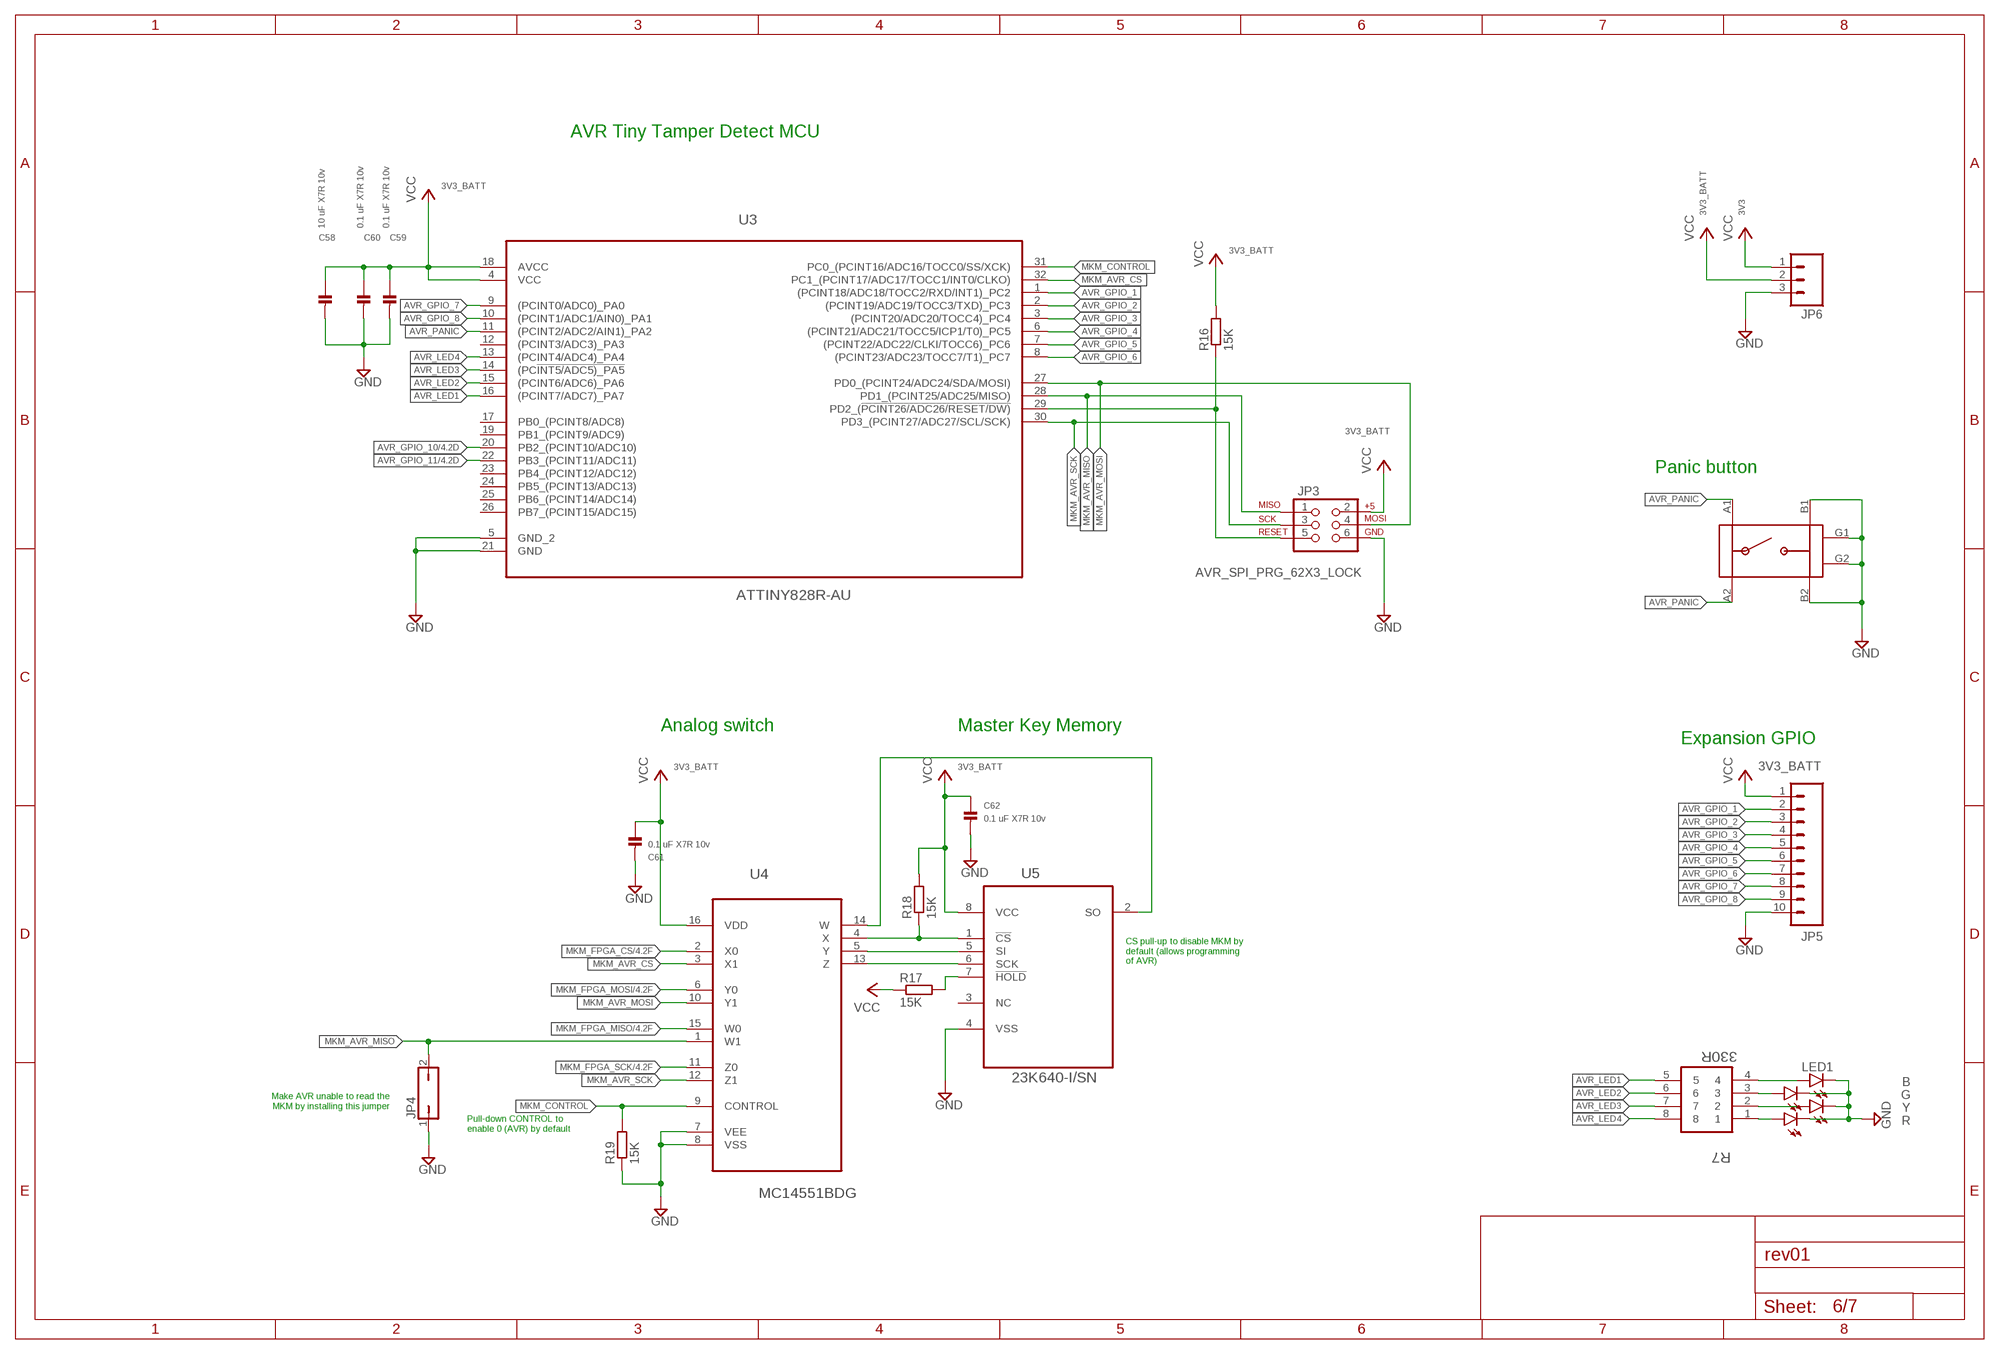
[diagram p6: schematic, sheet 6]

### Parts
C58  10 uF X7R 10v  CAP_CERAMIC0805  [0805]
C59  0.1 uF X7R 10v  CAP_CERAMIC0603  [0603]
C60  0.1 uF X7R 10v  CAP_CERAMIC0603  [0603]
C61  0.1 uF X7R 10v  CAP_CERAMIC0603  [0603]
C62  0.1 uF X7R 10v  CAP_CERAMIC0603  [0603]
JP3  AVR_SPI_PRG_62X3_LOCK  [2X3_LOCK]
JP4  JP1Q  [JP1]
JP5  M10LOCK  [1X10_LOCK]
JP6  M03LOCK  [1X03_LOCK]
LED1  B  LED0603  [LED-0603]
LED2  G  LED0603  [LED-0603]
LED3  Y  LED0603  [LED-0603]
LED4  R  LED0603  [LED-0603]
R7  330R  EXB38V331JV  [RESCAXE80P320X160X60-8N]
R16  15K  R-EU_R0603  [R0603]
R17  15K  R-EU_R0603  [R0603]
R18  15K  R-EU_R0603  [R0603]
R19  15K  R-EU_R0603  [R0603]
U3  ATTINY828R-AU  [QFP80P900X900X120-32N]
U4  MC14551BDG  [SOIC127P600X175-16N]
U5  23K640-I/SN  [SOIC127P600X175-8N]
U$4  TACTILE_SWITCH  [TACTILE_SWITCH]

### Nets
3V3: JP6.1 ; supply symbol labelled VCC ; also sheet 1,2,3,4,7
3V3_BATT: C58.1 C59.1 C60.1 C61.1 C62.1 JP3.2 JP5.1 JP6.2 R16.2 R17.1 R18.2 U3.4(VCC) U3.18(AVCC) U4.16(VDD) U5.8(VCC) ; supply symbol labelled VCC ; also sheet 7
!MKM_CS: R18.1 U4.4(X) U5.1(!CS)
AVR_GPIO_1: JP5.2 U3.1((PCINT18/ADC18/TOCC2/RXD/INT1)_PC2)
AVR_GPIO_2: JP5.3 U3.2((PCINT19/ADC19/TOCC3/TXD)_PC3)
AVR_GPIO_3: JP5.4 U3.3((PCINT20/ADC20/TOCC4)_PC4)
AVR_GPIO_4: JP5.5 U3.6((PCINT21/ADC21/TOCC5/ICP1/T0)_PC5)
AVR_GPIO_5: JP5.6 U3.7((PCINT22/ADC22/CLKI/TOCC6)_PC6)
AVR_GPIO_6: JP5.7 U3.8((PCINT23/ADC23/TOCC7/T1)_PC7)
AVR_GPIO_7: JP5.8 U3.9((PCINT0/ADC0)_PA0)
AVR_GPIO_8: JP5.9 U3.10((PCINT1/ADC1/AIN0)_PA1)
AVR_GPIO_10: U3.20(PB2_(PCINT10/ADC10)) ; also sheet 4
AVR_GPIO_11: U3.22(PB3_(PCINT11/ADC11)) ; also sheet 4
AVR_LED1: R7.5 U3.16((PCINT7/ADC7)_PA7)
AVR_LED2: R7.6 U3.15((PCINT6/ADC6)_PA6)
AVR_LED3: R7.7 U3.14((PC!INT5/ADC5)_PA5)
AVR_LED4: R7.8 U3.13((PCINT4/ADC4)_PA4)
AVR_PANIC: U3.11((PCINT2/ADC2/AIN1)_PA2) U$4.A1 U$4.A2
AVR_RESET: JP3.5 R16.1 U3.29(PD2_(!PCINT26/ADC26/RESET/DW))
GND [Ground]: C58.2 C59.2 C60.2 C61.2 C62.2 JP3.6 JP4.1 JP5.10 JP6.3 LED1.C LED2.C LED3.C LED4.C R19.1 U3.5(GND_2) U3.21(GND) U4.7(VEE) U4.8(VSS) U5.4(VSS) U$4.B1 U$4.B2 U$4.G1 U$4.G2 ; also sheet 1,2,4,5,7
MKM_AVR_CS: U3.32(PC1_(PCINT17/ADC17/TOCC1/INT0/CLKO)) U4.3(X1)
MKM_AVR_MISO: JP3.1 JP4.2 U3.28(PD1_(PCINT25/ADC25/MISO)) U4.1(W1)
MKM_AVR_MOSI: JP3.4 U3.27(PD0_(PCINT24/ADC24/SDA/MOSI)) U4.10(Y1)
MKM_AVR_SCK: JP3.3 U3.30(PD3_(PCINT27/ADC27/SCL/SCK)) U4.12(Z1)
MKM_CONTROL: R19.2 U3.31(PC0_(PCINT16/ADC16/TOCC0/SS/XCK)) U4.9(CONTROL)
MKM_FPGA_CS: U4.2(X0) ; also sheet 4
MKM_FPGA_MISO: U4.15(W0) ; also sheet 4
MKM_FPGA_MOSI: U4.6(Y0) ; also sheet 4
MKM_FPGA_SCK: U4.11(Z0) ; also sheet 4
MKM_MISO: U4.14(W) U5.2(SO)
MKM_MOSI: U4.5(Y) U5.5(SI)
MKM_SCK: U4.13(Z) U5.6(SCK)
N$4: LED1.A R7.4
N$5: LED2.A R7.3
N$15: LED3.A R7.2
N$16: LED4.A R7.1
N$31: R17.2 U5.7(!HOLD)
Unconnected: U3.12((PCINT3/ADC3)_PA3) U3.17(PB0_(PCINT8/ADC8)) U3.19(PB1_(PCINT9/ADC9)) U3.23(PB4_(PCINT12/ADC12)) U3.24(PB5_(PCINT13/ADC13)) U3.25(PB6_(PCINT14/ADC14)) U3.26(PB7_(PCINT15/ADC15)) U5.3(NC)

### Notes on the sheet
- AVR Tiny Tamper Detect MCU
- Panic button
- Analog switch | Master Key Memory
- Expansion GPIO
- CS pull-up to disable MKM by
  default (allows programming
  of AVR)
- Make AVR unable to read the
  MKM by installing this jumper
- Pull-down CONTROL to
  enable 0 (AVR) by default

## Sheet 7 of 7: RTC
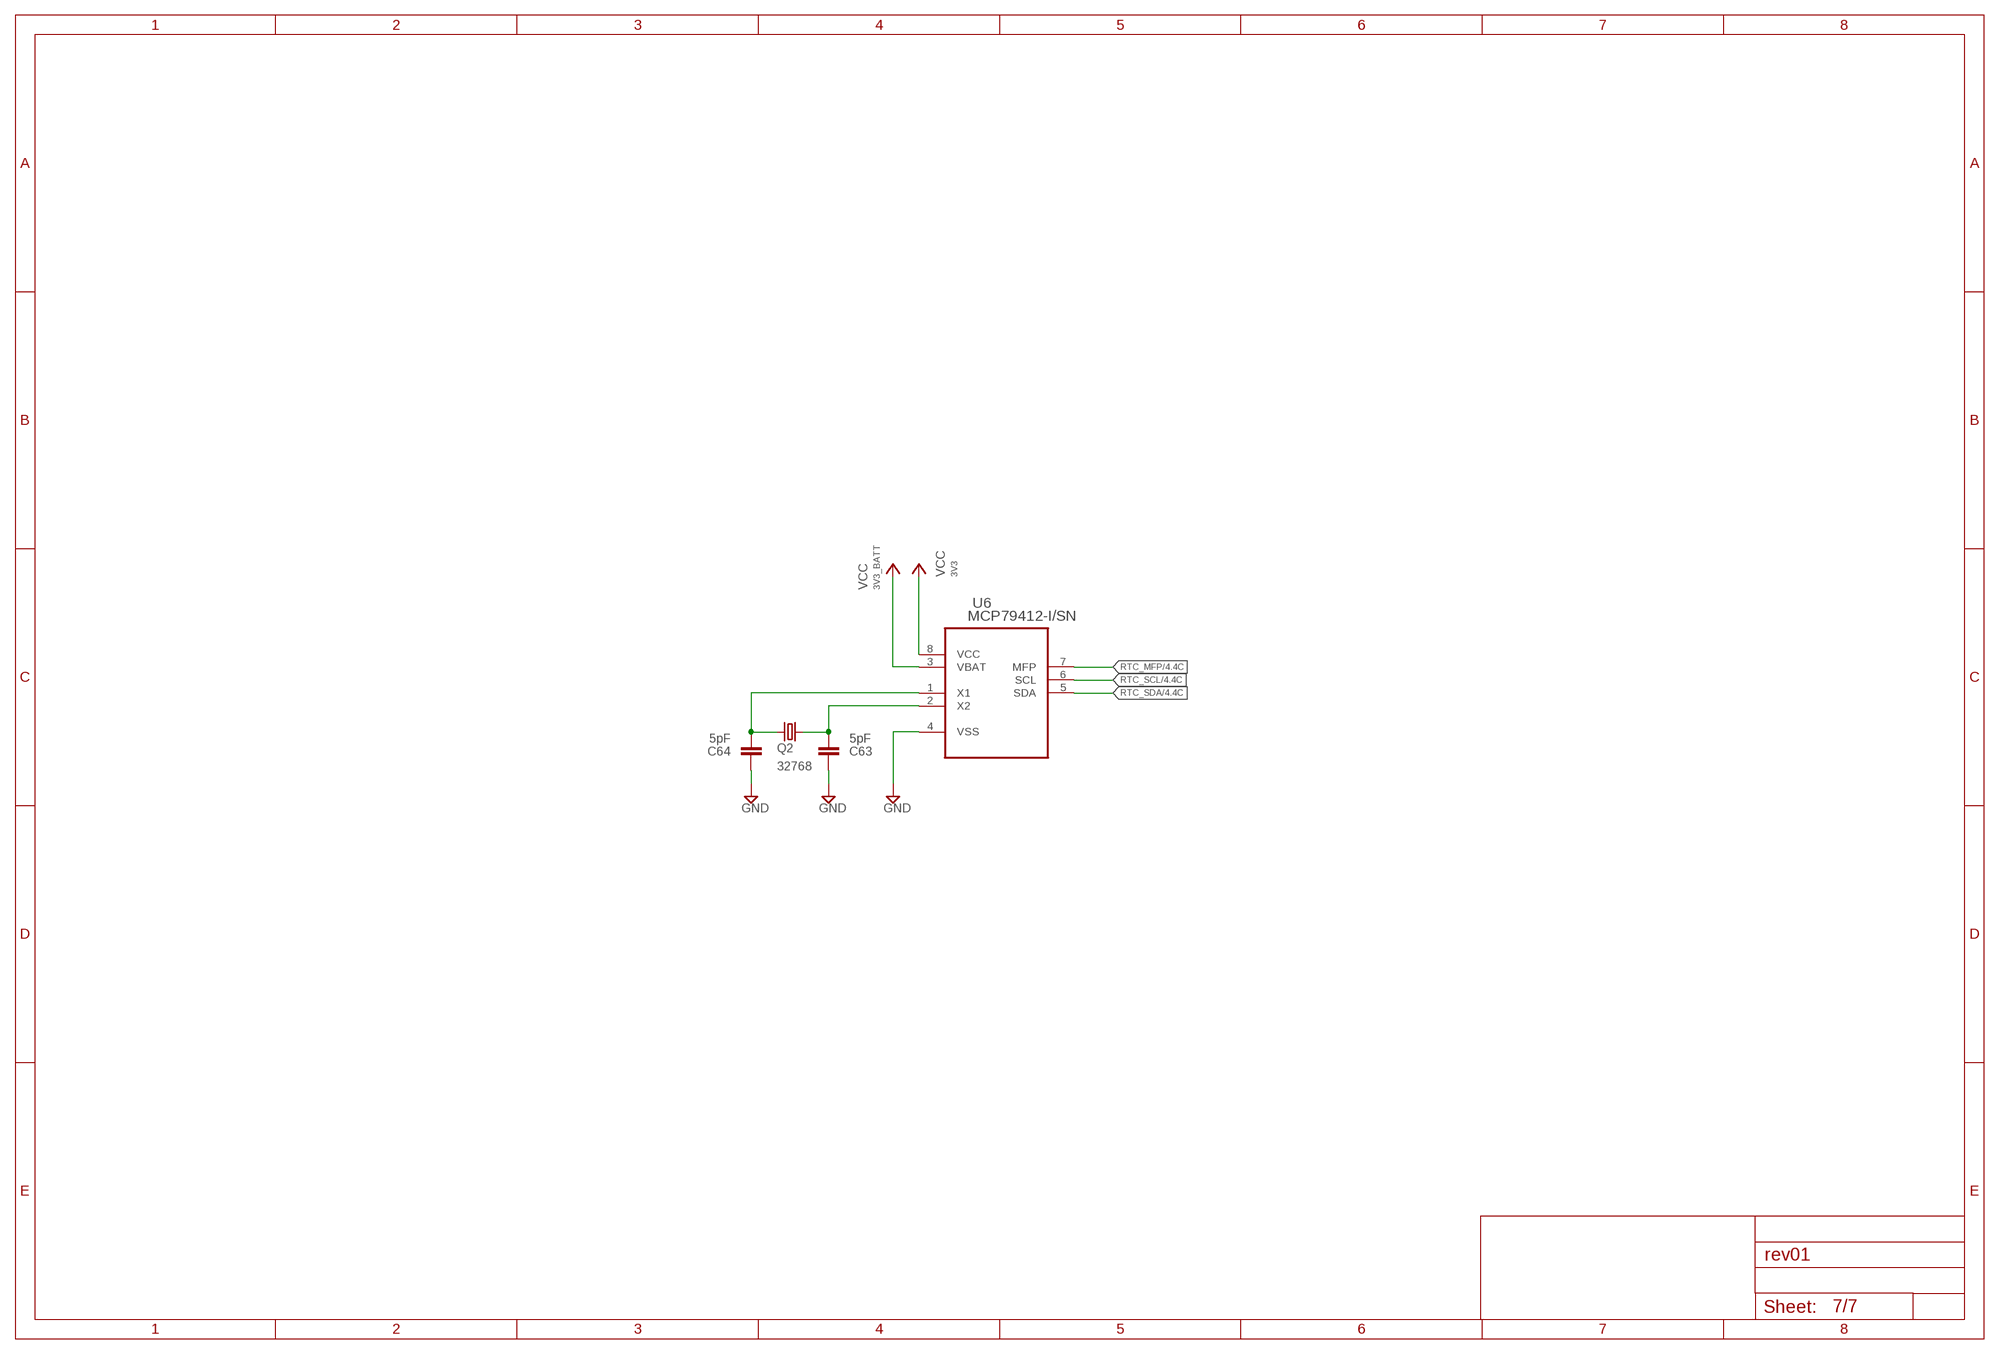
[diagram p7: schematic, sheet 7]

### Parts
C63  5pF  C-EUC0603  [C0603]
C64  5pF  C-EUC0603  [C0603]
Q2  32768  CRYSTALTC26H  [TC26H]
U6  MCP79412-I/SN  [SOIC127P600X175-8N]

### Nets
3V3: U6.8(VCC) ; supply symbol labelled VCC ; also sheet 1,2,3,4,6
3V3_BATT: U6.3(VBAT) ; supply symbol labelled VCC ; also sheet 6
GND [Ground]: C63.1 C64.1 U6.4(VSS) ; also sheet 1,2,4,5,6
RTC_MFP: U6.7(MFP) ; also sheet 4
RTC_SCL: U6.6(SCL) ; also sheet 4
RTC_SDA: U6.5(SDA) ; also sheet 4
RTC_X1: C64.2 Q2.1 U6.1(X1)
RTC_X2: C63.2 Q2.2 U6.2(X2)

## Power pins joined to a net without a drawn wire
GND: CON1.GND1(GND) CON1.GND2(GND) CON1.GND3(GND) CON1.GND4(GND) CON1.GND5(GND) CON1.GND6(GND) CON1.GND8(GND)

## Library data of the parts
C1 C5 C9 C11 = UsedComponents:EEE-: Aluminum Electrolytic Capacitors,Surface Mount Type; MPN: EEE-FK1V100UR; OC_FARNELL: 9695826; SUPPLIER: PANASONIC; TOLERANCE: ±20; VOLTAGERATING: 35V
C2 C3 C8 C13-C15 C43 C44 C63 C64 = rcl:C-EU: CAPACITOR, European symbol
C4 C6 C7 C10 C12 C16-C42 C45-C62 = microbuilder:CAP_CERAMIC: Ceramic Capacitors 0402 - 0402 Surface Mount Capacitors 16pF 50V 5% [Digikey: 445-4899-2-ND] 18pF 50V 5% [Digikey: 490-1281-2-ND] 22pF 50V 5% [Digikey: 490-1283-2-ND] 68pF 50V 5% [Digikey: 490-1289-2-ND] 0.1uF 10V 10% [Digikey: 490-1318-2-ND] 1.0uF 6.3V 10% [Digikey: 490-1320-2-ND] 0603 - 0603 Surface Mount Capacitors 16 pF 50V 5% [Digikey: 445-5051-2-ND] 22 pF 50V [Digikey: PCC220ACVTR-ND] 33 pF 50V 5% [Digikey: 490-1415-1-ND] 56pF 50V 5% [Digikey: 490-1421-1-ND] 220pF 50V 5% [Digikey: 445-1285-1-ND] 680 pF 50V 2200 pF 50V 5% C0G [Digikey: 445-1297-1-ND] 5600 pF 100V 5% X7R [Digikey: 478-3711-1-ND] 0.1 µF 25V 10% [Digikey: PCC2277TR-ND] 0.22 µF 16V 10% X7R [Digikey: 445-1318-1-ND] 1.0 µF 25V 10% [Digikey: 445-5146-2-ND] 0603 - RF Specific 3pF 250V +/-0.1pF RF [Digikey: 712-1347-1-ND] 18 pF 250V 5% [Digikey: 478-3505-1-ND or 712-1322-1-ND] 56 pF 250V 5% C0G RF [Digikey: 490-4867-1-ND] 68 pF 250V RF [Digikey: 490-4868-1-ND] 0805 - 0805 Surface Mount Capacitors 220 pF 250V 2% RF Ceramic Capacitor [Digikey: 712-1398-1-ND] 1000 pF 50V 2% NP0 Ceramic Capacitor [Digikey: 478-3760-1-ND] 0.1 µF 25V 10% Ceramic Capacitor [Digikey: PCC1828TR-ND] 1.0 µF 16V 10% Ceramic Capacitor[Digikey: 490-1691-2-ND] 10.0 µF 10V 10% Ceramic Capacitor[Digikey: 709-1228-1-ND] 10.0 uF 16V 10% Ceramic Capacitor [Digikey: 478-5165-2-ND] 47 uF 6.3V 20% Ceramic Capacitor [Digikey: 587-1779-1-ND or 399-5506-1-ND] 1206 - 1206 Surface Mount Capacitors 47uF 10V 20% Ceramic Capacitor [Digikey: 490-5528-1-ND or 399-5508-1-ND or 445-6010-1-ND] 100uF 6.3V -20%, +80% Y5V Ceramic Capacitor (Digikey: 490-4512-1-ND, Mouser: 81-GRM31CF50J107ZE1L)
CN1 = adafruit:USB: USB Connectors USBMINIB - Surface Mount Female Mini-B USB Connector 4UConnector: 06564 By microbuilder.eu Thru-hole RA Female Mini-B USB Connector 4UConnector: 18732 By ladyada.net
CON1 = Novena_FX10A-80S:FX10*-80S/8-SV(71): HRS FX10A-80S/8-SV(71) 10+ Gbps 0.5 mm pitch Stacking Connectors This is the connector used to connect the General Purpose Breakout Board (GPBB) to the Novena.
D1 = diode:BAT54: Schottky Diodes Source: Fairchild .. BAT54.pdf
D2 = diode:BAT54C: Schottky Diodes Source: Fairchild .. BAT54.pdf
FB1 FB2 = microbuilder:FERRITE: Ferrite Bead 0603 MMZ1608B121C - 120 Ohm @ 100MHz, 600mA, 0.15 Ohm DC Resistance - Digikey: 445-2164-1-ND BK1608HW121-T - 120 Ohm, 600mA Ferrite Chip - Digikey: 587-1876-2-ND 0805 HZ0805B272R-10 - 2.7K Ohm @ 100MHz, 200mA, 0.8 Ohm DC Resistance - Digikey: 240-2504-1-ND (see also Murata BLM21BD272SN1L) MMZ2012Y152B - 1.5K Ohm @ 100MHz, 500mA, 0.4 Ohm DC Resistance - Digikey: 445-1560-1-ND - Mainly for high frequency (80-400MHz) MMZ2012R102A - 1K Ohm @ 100MHz, 500mA, 0.3 Ohm DC Resistance - Digikey: 445-1555-2-ND - More general purpose (10-200MHz)
FID1-FID15 = UsedComponents:FIDUCIAL: Fiducial Alignment Points Various fiducial points for machine vision alignment.
IC1 IC2 = maxim:ICL7660CSA: VOLTAGE CONVERTER; MF: MAXIM; MPN: ICL7660CSA; OC_FARNELL: 9724710; OC_NEWARK: 34C3732
JP1 = SparkFun-Connectors:M04: Header 4 Standard 4-pin 0.1" header. Use with straight break away headers (SKU : PRT-00116), right angle break away headers (PRT-00553), swiss pins (PRT-00743), machine pins (PRT-00117), and female headers (PRT-00115). Molex polarized connector foot print use with SKU : PRT-08231 with associated crimp pins and housings. 1MM SMD Version SKU: PRT-10208
JP2 JP6 = SparkFun-Connectors:M03: Header 3 Standard 3-pin 0.1" header. Use with straight break away headers (SKU : PRT-00116), right angle break away headers (PRT-00553), swiss pins (PRT-00743), machine pins (PRT-00117), and female headers (PRT-00115). Molex polarized connector foot print use with SKU : PRT-08232 with associated crimp pins and housings.
JP3 = SparkFun-Connectors:AVR_SPI_PRG_6: AVR ISP 6 Pin This is the reduced ISP connector for AVR programming. Common on Arduino. This footprint will take up less PCB space and can be used with a 10-pin to 6-pin adapter such as SKU: BOB-08508 **Special note about "TEST_POINT" package. The stop mask is on the top side, so if you want your programming test points to be on the bottom of your board, make sure to place this package on the bottom side of the board. This also ensure that the orientation to program from the bottom side will be correct.
JP4 = jumper:JP1Q: JUMPER
JP5 = SparkFun-Connectors:M10: Header 10 Standard 10-pin 0.1" header. Use with straight break away headers (SKU : PRT-00116), right angle break away headers (PRT-00553), swiss pins (PRT-00743), machine pins (PRT-00117), and female headers (PRT-00115).
L1 L2 = microbuilder:INDUCTOR: Inductors 0603: 10nH Ceramic Inductor - microwire antenna/RF (Digikey: 712-1434-2-ND) 0805: 560nH Ceramic Inductor - RF (Digikey: 553-1047-1-ND) 270nH Ceramic Inductor - Q = 40@250MHz, +-5%, 1 Ohm DC Resistance (Digikey: 535-10506-2-ND) 1007 (2518 Metric) SMT: 10µH 10% 250mOhm 820mA 1007 Inductor (Digikey: 587-2189-1-ND) 22µH 10% 500mOhm 580mA 1007 Inductor (Digikey: 587-2190-1-ND) 47µH 10% 950mOhm 420mA 1007 Inductor (Digikey: 587-2191-1-ND) 47µH 5% 100mOhm 1A 1008 Inductor (Digikey: 732-1816-1-ND) 5.0x5.0mm (Taiyo Yuden NR5040 Series) 6.8µH 20% 2.3A 64mOhm Inductor (Digikey: 587-2374-2-ND) 5.0x5.0mm (TDK VLC5045 Series) 4.7µH 20% 3.3A 34mOhm Inductor (Digikey: 445-6526-1-ND) 6.8µH 20% 2.7A 46mOhm Inductor (Digikey: 445-6527-1-ND) 6.0x6.0mm (TDK VLC6045 Series) 4.7µH 20% 3.8A 27mOhm Inductor (Digikey: 445-6538-2-ND) 6.8µH 20% 3A 41mOhm Inductor (Digikey: 445-6540-1-ND) 6.2µH 30% 2.2A 45mOhm Inductor (Digikey: SRR5028-6R2YCT-ND) - Not TDK VLC6045 but footprint should match 6.0x6.0mm (TDK SLF6045 Series) 6.8uH 30% 2A 33mOhm Inductor (Digikey: 445-4572-1-ND, Mouser: 810-SLF645T6R8N2R0PF)
LED1-LED10 = SparkFun-LED:LED: LEDs Standard schematic elements and footprints for 5mm, 3mm, 1206, and 0603 sized LEDs. 5mm - Spark Fun Electronics SKU : COM-00529 (and others)
LOGO1 = SparkFun-Aesthetics:OSHW-LOGO: Open Source Hardware Logo as defined here: http://freedomdefined.org/OSHW
ORANGE = UsedComponents:LED: LEDs Standard schematic elements and footprints for 5mm, 3mm, 1206, and 0603 sized LEDs. 5mm - Spark Fun Electronics SKU : COM-00529 (and others); OC_FARNELL: 1652077
Q1 = adafruit:CRYSTAL: CRYSTAL; OC_FARNELL: unknown; OC_NEWARK: unknown
Q2 = crystal:CRYSTAL: CRYSTAL; OC_FARNELL: unknown; OC_NEWARK: unknown
R1-R6 R10-R19 = resistor:R-EU_: RESISTOR, European symbol
R7 R8 = Panasonic-EXB-ERJ:EXB38V: Chip Resistor Array; MPN: EXB38V331JV; OC_FARNELL: 2060095; OC_NEWARK: 65T9098; PACKAGE: 0603; POWERRATING: 0.063 W/element; SUPPLIER: PANASONIC; TOLERANCE: ±5 %
S1 = WE-SHC:WE-SHC: WE-SHC Shielding cabinet
SJ1 = microbuilder:SOLDERJUMPER_CLOSED: Solder Jumper - Closed These solder jumpers are closed by default CLOSEDWIRE - 10 mil trace between pads that can be cut and resoldered later CLOSEDPERM - 63 mil trace between pads for a permanent connection (used to 'bridge' two signals, a shameless hack for Eagle). Can double as a test point as well (no cream layer)
SJ3 SJ4 = microbuilder:SOLDERJUMPER: SMD Solder JUMPER Solder the two pads together to create a connection, or remove the solder to break it. REFLOW - Use this footprint for solder paste and reflow ovens. WAVE - Use this footprint for hand-soldering (larger pads). CLOSED - Has a trace between the two pads to ensure it is closed by default. The trace needs to be cut to disable the jumper, and can be closed again by creating a solder bridge between the two pads.
T1 T2 = transistor:BC847: NPN TRANSISTOR
T3 = transistor-npn:BC818*: NPN Transistor
TP1 TP2 = testpad:TP: Test pad
U1 = LP3985IM5:LP3985IM5-3.3: Low-Dropout CMOS Voltage Regulator; MPN: LP3985IM5-3.3; OC_FARNELL: 1469025; OC_NEWARK: 23K8224; PACKAGE: SOT-5; SUPPLIER: NationalSemiconductor
U2 = MC74HC1G14DTT1G:MC74HC1G14DTT1G: Single Inverter with Schmitt-Trigger Input; MPN: MC74HC1G14DTT1G; OC_FARNELL: 1468757; OC_NEWARK: 71J5593; PACKAGE: SOT-23-5; SUPPLIER: ON SEMICONDUCTOR
U3 = ATMEL-ATTINY828R-AU:ATTINY828R-AU: IC, MCU, 8KB, FLASH, 20MHZ, TQFP-32; MPN: ATTINY828R-AU; OC_FARNELL: 2249850; OC_NEWARK: Unknown; PACKAGE: TQFP-32; SUPPLIER: ATMEL
U4 = ON_Semiconductor-MC14551BDG:MC14551BDG: Quad 2-Channel Analog Multiplexer/Demultiplexer; MPN: MC14551BDG; OC_FARNELL: 9665242; OC_NEWARK: 71J5501; PACKAGE: SOIC-16; SUPPLIER: ON SEMICONDUCTOR
U5 = Microchip-23K640-I_SN:23K640-I/SN: 64K SPI Bus Low-Power Serial SRAM,SOIC-8; MPN: 23K640-I/SN; OC_FARNELL: 1695549; OC_NEWARK: 71P4706; PACKAGE: SOIC-8; SUPPLIER: MICROCHIP
U6 = MCP79412:MCP79412-I/SN: RTCC, I2C, 1K EE, 64B SRAM, 8SOIC; MPN: MCP79412-I/SN; OC_FARNELL: 2103565; OC_NEWARK: 94T5863; PACKAGE: SOIC-8; SUPPLIER: Microchip
U$1 = STM32F429:STM32F429BIT6: STM32F429 Cortex-M4 CPU 180 MHz, 256 KB RAM, 2 MB Flash; OC_FARNELL: 2469581
U$2 = STM32-SWD-connector:STM32-SWD: STM32 SWD connector
U$3 = FT232H:FT232H_SERIAL: INTERFACE, USB - UART/FIFO; OC_FARNELL: 1870924
U$4 = UsedComponents:TACTILE_SWITCH; OC_FARNELL: 2425618
USB_PWR = SparkFun-Connectors:USB: USB Connectors USB-B-PTH is fully proven SKU : PRT-00139/CONN-08278 USB-miniB is fully proven SKU : PRT-00587 USB-A-PCB is untested. USB-A-H is throughly reviewed, but untested. Spark Fun Electronics SKU : PRT-00437 USB-B-SMT is throughly reviewed, but untested. Needs silkscreen touching up. USB-A-S has not been used/tested USB-MB-H has not been used/tested USB-MICROB has been used. CONN-09505; PROD_ID: CONN-09505
Y1 = microbuilder:CRYSTAL: Crystals HC49UP - Surface Mount Crystal 4.0MHz 18pF +/-30ppm Surface Mount Crystal [Digikey: 535-9857-1-ND] 12.0 MHz Surface Mount Crystal [Digikey: 535-9869-6-ND] 25.0 MHz Surface Mount Crystal [Digikey: 535-9078-1-ND] 2.5 x 2.0mm - MEMs SMT Crystal 16.0 MHz 10pF 20ppm 2.5 x 2.0mm Crystal [Digikey -40-85°C: 535-10923-1-ND] 3.2 x 2.5mm - MEMs SMT Crystal 12.0 MHz 8pF 15ppm 3.2 x 2.5mm Crystal [Digikey: -10-70°C: 644-1047-1-ND -40-125°C: 644-1128-1-ND] 16.0 MHz 8pF 15ppm 3.2 x 2.5mm Crystal [Digikey: -10-70°C: 644-1049-1-ND -40-125°C: 644-1129-2-ND] 16.0 MHz 10pF 10ppm 3.2 x 2.5mm Crystal [Digikey: 644-1100-1-ND] 27.12 MHz 18pF 30ppm 3.2 x 2.5mm Crystal [Digikey: 887-1424-1-ND] 27.12MHz 10pF 10ppm 3.2 x 2.5mm Crystal [Digikey: 887-1329-1-ND] 4.9 x 1.8mm - MEMs SMT Crystal 32.768 KHz 12.5pF 20ppm 4.9 x 1.8mm Crystal [Digikey: SE2415CT-ND] 8.0 x 3.8mm - Surface Mount Crystal 32.768kHz 12.5pF 20ppm -40°C-85°C [Digikey: 535-9166-2-ND] Cylinder 32.768KHz Cylinder Crystal (2x6mm body) [Ex. Digikey: 300-8341-2-ND]

## Net classes
1 Ground: width 0.203 mm, drill 0.508 mm